# Altium project mcHFPro_ui.PrjPcb (part 2 of 2)

## Sheet ui_lo.SchDoc: mcHF Pro Transceiver UI board
size A3; Author: Krassi Atanassov; CompanyName: MØNKA; Engineer: For radio amateurs experimentation, non-commercial use only. Thank you!; Revision: 0.8.5; SheetTotal: 13
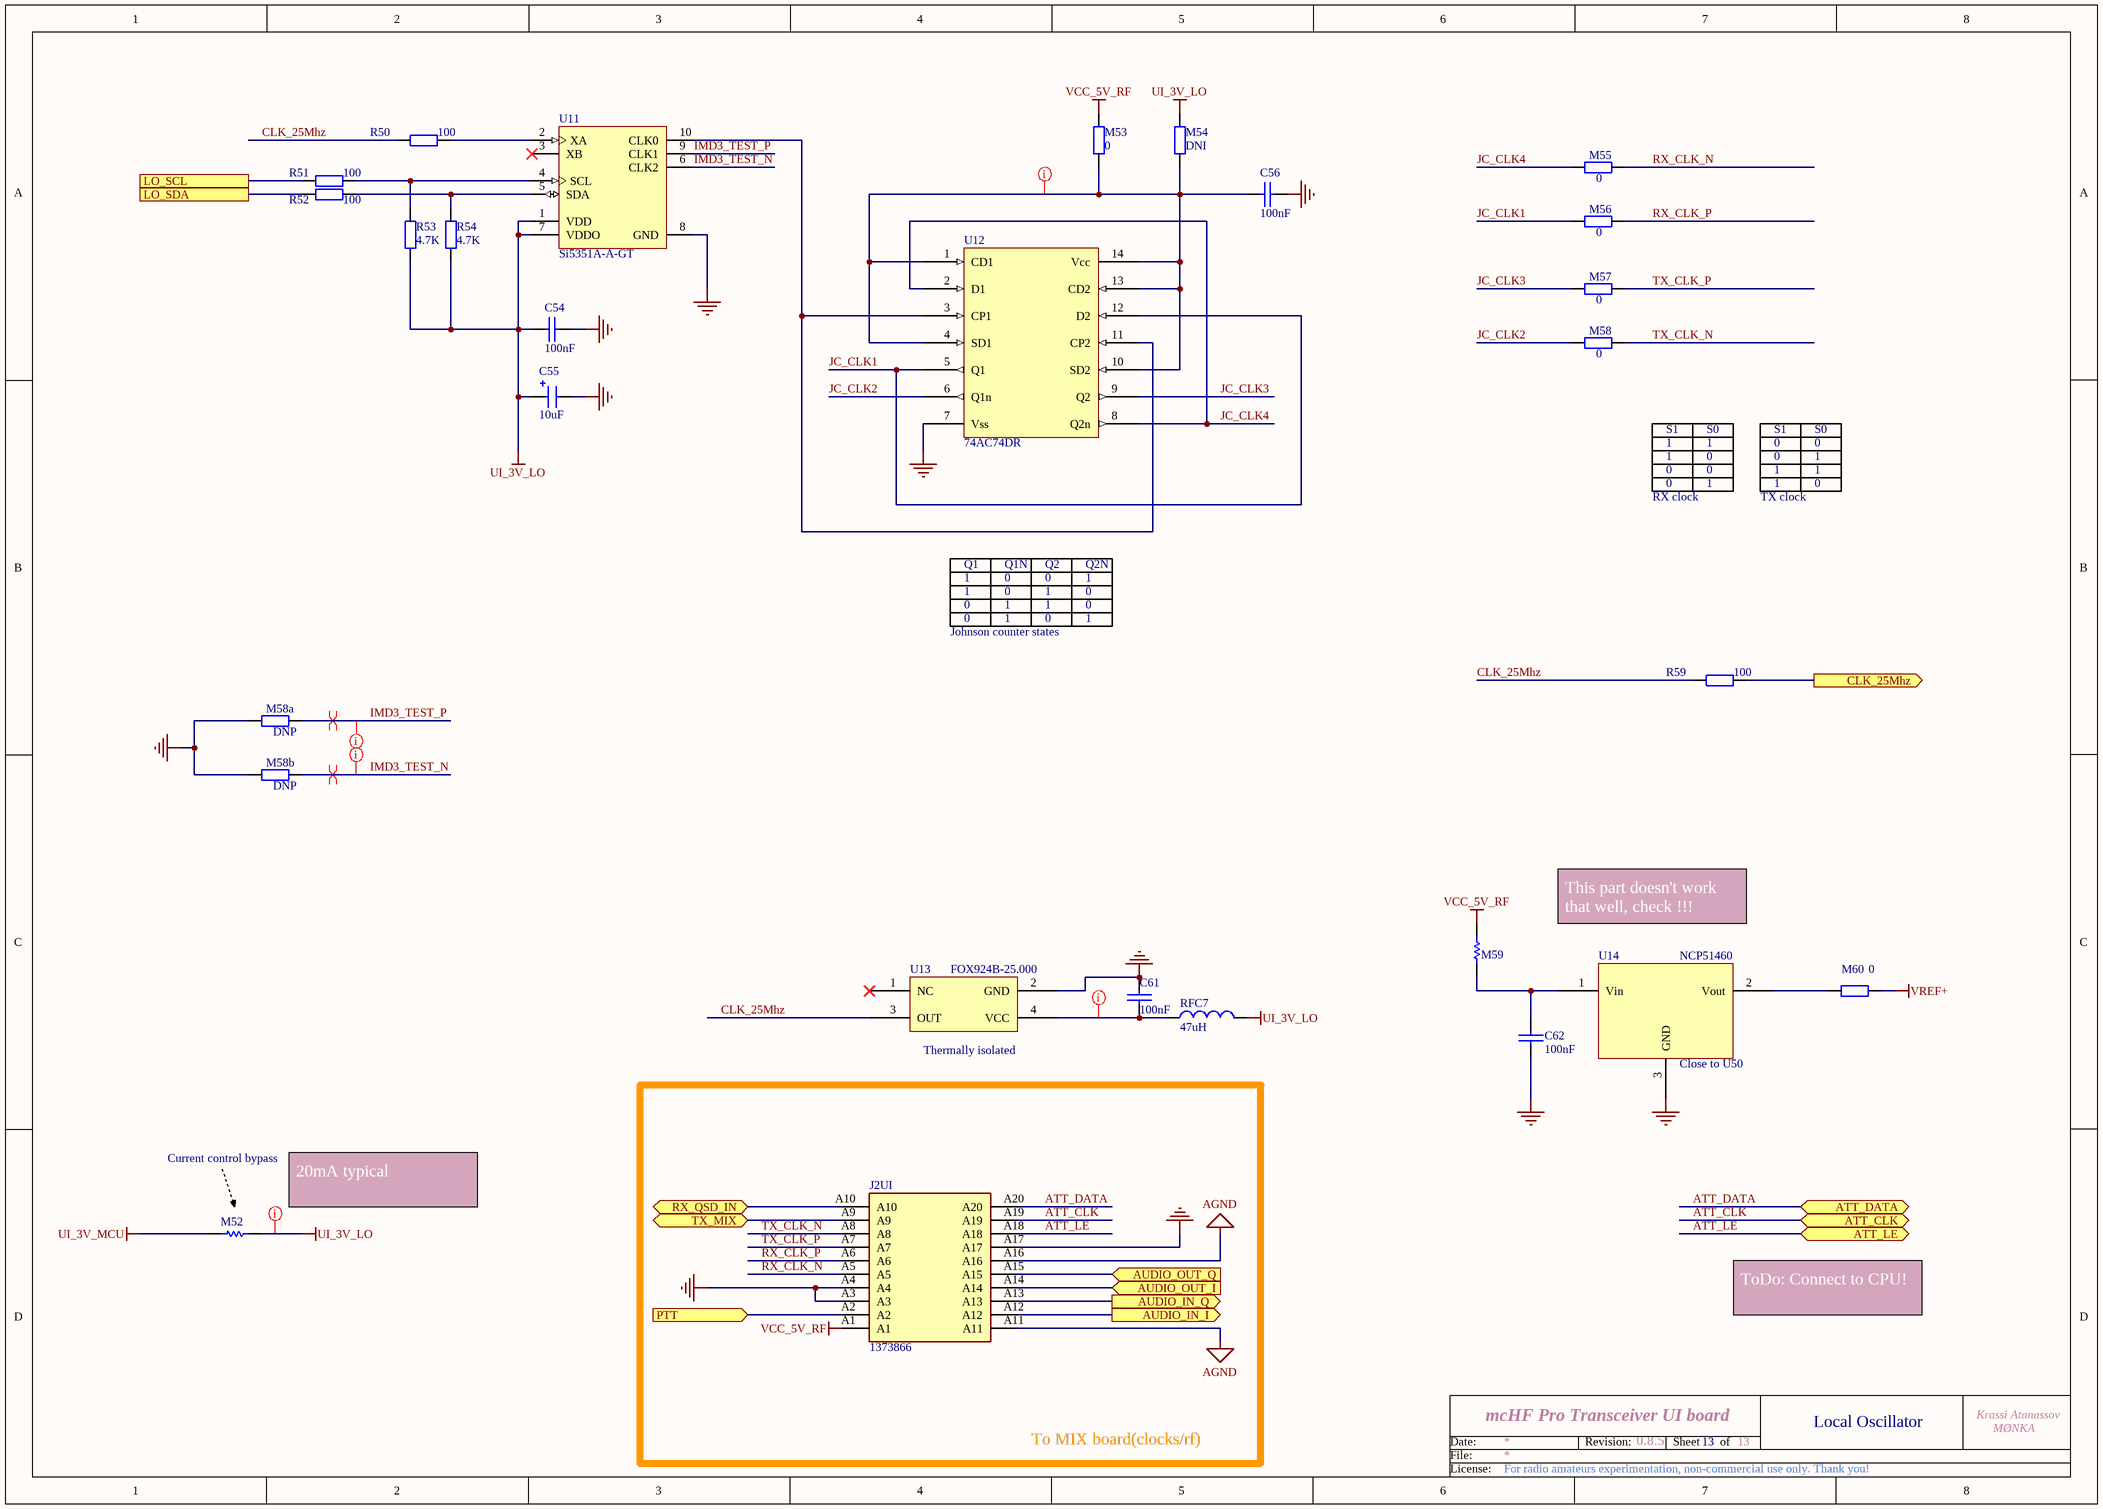
[diagram p7: ui_lo.SchDoc]

### Parts
C54  100nF  [0805]
C55  10uF  [1206_Elec_Cap]
C56  100nF  [0805]
C61  100nF  [0805]
C62  100nF  [0805]
J2UI  1373866  [YuanQi4mm]
M52  0  [SB_0603]  (value not drawn)  (net tie, no BOM)
M53  0  [0805]
M54  DNI  [0805]  (no BOM)
M55  0  [0805]
M56  0  [0805]
M57  0  [0805]
M58  0  [0805]
M58a  DNP  [0805]  (no BOM)
M58b  DNP  [0805]  (no BOM)
M59  0  [SB_0603]  (value not drawn)  (net tie, no BOM)
M60  0  [0805]
R50  100  [0805]
R51  100  [0805]
R52  100  [0805]
R53  4.7K  [0805]
R54  4.7K  [0805]
R59  100  [0805]
RFC7  47uH  [0805]
U11  Si5351A-A-GT  [SLAB-MSOP-10_N]
U12  74AC74DR  [SO-14]
U13  FOX924B-25.000  [2SMX-3SMXB]
U14  NCP51460  [SOT-23]

### Blocks framed on the sheet
To MIX board(clocks/rf): J2UI

### Ports
ATT_CLK (bidir), ATT_DATA (bidir), ATT_LE (bidir), AUDIO_IN_I (out), AUDIO_IN_Q (out), AUDIO_OUT_I (in), AUDIO_OUT_Q (in), CLK_25Mhz (out), LO_SCL, LO_SDA, PTT (in), RX_QSD_IN (bidir), TX_MIX (bidir)

### Nets
AGND: J2UI.A11 J2UI.A16
GND: C54.2 C55.2 C56.1 C61.1 C62.2 J2UI.A3 J2UI.A4 J2UI.A17 M58a.2 M58b.2 U11.8(GND) U12.7(Vss) U13.2(GND) U14.3(GND)
UI_3V_LO: C54.1 C55.1 M52.2 M54.2 R53.2 R54.2 RFC7.2 U11.1(VDD) U11.7(VDDO)
UI_3V_MCU: M52.1
VCC_5V_RF: J2UI.A1 M53.2 M59.2
VREF+: M60.1
ATT_CLK: J2UI.A19 ; port ATT_CLK
ATT_DATA: J2UI.A20 ; port ATT_DATA
ATT_LE: J2UI.A18 ; port ATT_LE
CLK_25Mhz: R50.2 R59.2 U13.3(OUT)
IMD3_TEST_N: M58b.1 U11.6(CLK2)
IMD3_TEST_P: M58a.1 U11.9(CLK1)
JC_CLK1: M56.2 U12.5(Q1) U12.12(D2)
JC_CLK2: M58.2 U12.6(Q1n)
JC_CLK3: M57.2 U12.9(Q2)
JC_CLK4: M55.2 U12.2(D1) U12.8(Q2n)
LO_SCL: R51.2 ; port LO_SCL
LO_SDA: R52.2 ; port LO_SDA
PTT: J2UI.A2 ; port PTT
RX_CLK_N: J2UI.A5 M55.1
RX_CLK_P: J2UI.A6 M56.1
RX_QSD_IN: J2UI.A10 ; port RX_QSD_IN
TX_CLK_N: J2UI.A8 M58.1
TX_CLK_P: J2UI.A7 M57.1
TX_MIX: J2UI.A9 ; port TX_MIX
NetC6_2: J2UI.A14 ; port AUDIO_OUT_I
NetC7_2: J2UI.A15 ; port AUDIO_OUT_Q
NetC8_2: J2UI.A12 ; port AUDIO_IN_I
NetC9_2: J2UI.A13 ; port AUDIO_IN_Q
NetC56_2: C56.2 M53.1 M54.1 U12.1(CD1) U12.4(SD1) U12.10(SD2) U12.13(CD2) U12.14(Vcc)
NetC61_2: C61.2 RFC7.1 U13.4(VCC)
NetC62_1: C62.1 M59.1 U14.1(Vin)
NetM60_2: M60.2 U14.2(Vout)
NetR50_1: R50.1 U11.2(XA)
NetR51_1: R51.1 R53.1 U11.4(SCL)
NetR52_1: R52.1 R54.1 U11.5(SDA)
NetR59_1: R59.1 ; port CLK_25Mhz
NetU11_10: U11.10(CLK0) U12.3(CP1) U12.11(CP2)

Not connected (* = marked no-connect by the designer): U11 3(XB)*; U13 1(NC)*

### Layout directives
rule Width Constraint [Pref Width = 12mil    Min Width = 12mil    Max Width = 12mil]: NetC56_2, NetC61_2, UI_3V_LO
differential pair: IMD3_TEST_N, IMD3_TEST_P
rule Matched Net Lengths [Tolerance = 300mil]: IMD3_TEST_N, IMD3_TEST_P

### Notes on the sheet
- S1
- 1
- S0
- 0
- RX clock
- TX clock
- Q1
- Q1N
- Q2
- Q2N
- Johnson counter states
- This part doesn't work that well, check !!!
- (near U13) Thermally isolated
- (near U14) Close to U50
- Current control bypass
- (near M52) 20mA typical
- ToDo: Connect to CPU!
- 13
- Local Oscillator
- Date:
- File:
- Revision:
- Sheet
- of
- License:

### Library data of the parts
C54 C56 C62 = CAP: as C22 on sheet ui_conn; Price: 0.068
C55 = CAP-POL: Electrolitic capacitor; Order: FN 233-3009; QT Order: QCC-00166; Price: 0.204
C61 = CAP: Capacitor; Order: FN 174-0673; QT Order: QCC-00154; Price: 0.068
J2UI = YQ_20p: SMD male connector, nominal current: 2.2 A, Test voltage: 840 VAC, number of positions: 20, pitch: 1.27 mm, color: black, contact surface: Gold, type of contact: Male connector, mounting: SMD soldering; Manufacturer_Name: Phoenix Contact; Geometry.Height: 6.75mm; Mouser Part Number: 651-1373866; Mouser Price/Stock: https://www.mouser.co.uk/ProductDetail/Phoenix-Contact/1373866?qs=2SLPxufLcgAs0enIXKjUUw%3D%3D; Manufacturer_Part_Number: 1373866; Datasheet Link: http://www.phoenixcontact.com/gb/produkte/1373866
M52 M59 = Link: Value: 1K; Published: 8-Jun-2000; Revision: July-2002: Re-released for DXP Platform.; Publisher: Altium Limited
M53-M58 M58a M58b M60 = RES: Resistor; Order: FN 933-3681; QT Order: QCR-00268; Price: 0.009
R50-R52 R59 = RES: Resistor; Order: FN 933-2375; QT Order: QCR-00301; Price: 0.027
R53 R54 = RES: as R21a on sheet ui_conn; Price: 0.024
RFC7 = Inductor: Order: FN 166-9895; Price: 0.16
U11 = Si5351A-A-GT: I2C-Programmable Any-Frequency CMOS Clock Generator + VCXO, 2.5 / 3.3 V, 0.008 to 160 MHz Output, -40 to 85 degC, 10-pin SOP; Manufacturer: Silicon Labs; Output Format: LVCMOS; Reference Inputs: 1; VDD: 2.5 V; 3.3 V; Sub-Family: Clock Generators; Notes: Farnell had it cheap (like 80 pence); DatasheetVersion: Rev. 0.95; PackageReference: MSOP-10; PackageDescription: 10-Pin Mini Small Outline Package, Body 3 x 3 mm, Pitch 0.5 mm; Supplier 1: Digi-Key; Supplier Part Number 1: 336-1994-5-ND; Supplier 2: Mouser; Supplier Part Number 2: 634-SI5351A-A-GT; Output Frequency (MHz): 0.008 to 160; Mounting Technology: Surface Mount; Code_JEDEC: MO-187; Code_IPC: J-STD-020; PartNumber: Si5351A-A-GT; ComponentLink1Description: Manufacturer URL; ComponentLink1URL: http://www.silabs.com/; ComponentLink2Description: Datasheet; ComponentLink2URL: http://www.silabs.com/Support%20Documents/TechnicalDocs/Si5351.pdf; ComponentLink3Description: Package Specification; ComponentLink3URL: http://www.silabs.com/Support Documents/TechnicalDocs/C8051T60x.pdf
U12 = 74LCX74M: Low Voltage Dual D-Type Positive Edge-Triggered  Flip-Flop with 5V Tolerant Inputs; Order: FN 985-3502; QT Order: QCI-00713; Notes: Can use PO74G74A, but remove M52, install M53; Price: 0.23
U13 = FOX924B-16.000: TCXO; Order: FN 206-3959; Price: 2.77
U14 = NCP51460: 3.3V voltage reference, SOT-23

## Sheet ui_ext_conn.SchDoc: mcHF Pro Transceiver UI board
size A3; Author: Krassi Atanassov; CompanyName: MØNKA; Engineer: For radio amateurs experimentation, non-commercial use only. Thank you!; Revision: 0.8.5; SheetTotal: 13
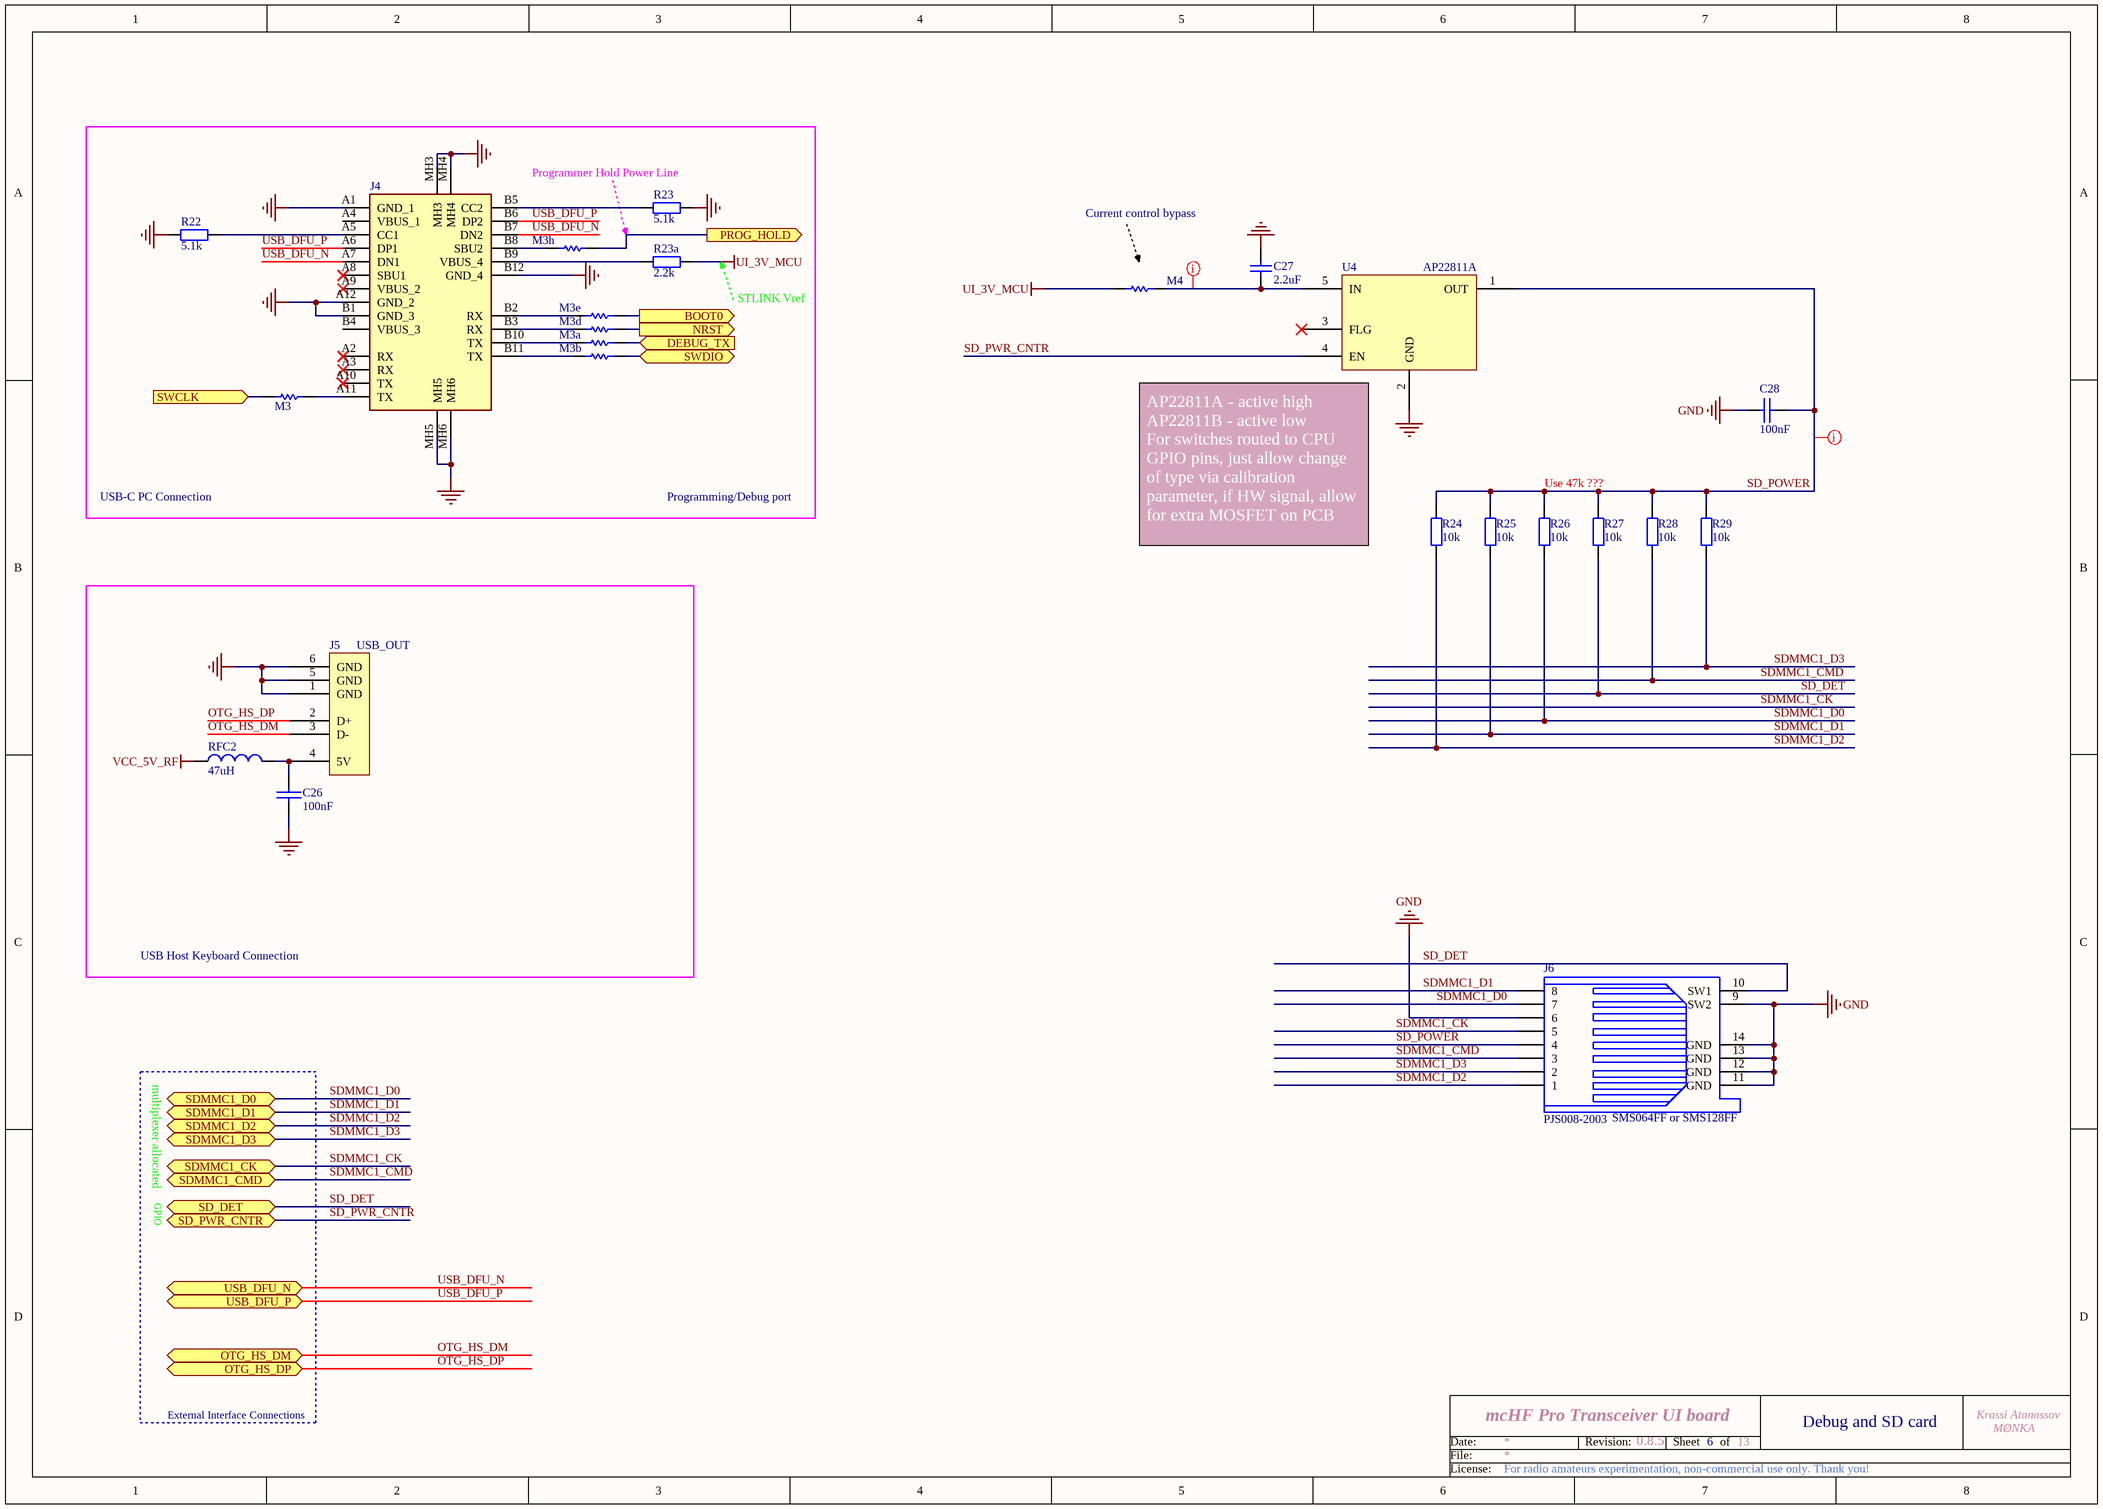
[diagram p8: ui_ext_conn.SchDoc]

### Parts
C26  100nF  [0805]
C27  2.2uF  [0805]
C28  100nF  [0805]
J4  219320-0001  [usbc_24p]  (value not drawn)
J5  USB_OUT  [USB_OUT_A]
J6  PJS008-2003  [PJS008-2003-1]
M3  0  [SB_0603_NO]  (value not drawn)  (net tie, no BOM)
M3a  0  [SB_0603_NO]  (value not drawn)  (net tie, no BOM)
M3b  0  [SB_0603_NO]  (value not drawn)  (net tie, no BOM)
M3d  0  [SB_0603_NO]  (value not drawn)  (net tie, no BOM)
M3e  0  [SB_0603_NO]  (value not drawn)  (net tie, no BOM)
M3h  0  [SB_0603_NO]  (value not drawn)  (net tie, no BOM)
M4  0  [SB_0603]  (value not drawn)  (net tie, no BOM)
R22  5.1k  [0805]
R23  5.1k  [0805]
R23a  2.2k  [0805]
R24  10k  [0805]
R25  10k  [0805]
R26  10k  [0805]
R27  10k  [0805]
R28  10k  [0805]
R29  10k  [0805]
RFC2  47uH  [0805]
U4  AP22811A  [SOT25-5]

### Blocks framed on the sheet
USB Host Keyboard Connection: C26 J5 RFC2

### Ports
BOOT0 (out), DEBUG_TX (in), NRST (out), OTG_HS_DM (bidir), OTG_HS_DP (bidir), PROG_HOLD (out), SD_DET (bidir), SD_PWR_CNTR (bidir), SDMMC1_CK (bidir), SDMMC1_CMD (bidir), SDMMC1_D0 (bidir), SDMMC1_D1 (bidir), SDMMC1_D2 (bidir), SDMMC1_D3 (bidir), SWCLK (in), SWDIO (bidir), USB_DFU_N (bidir), USB_DFU_P (bidir)

### Nets
GND: C26.1 C27.1 C28.2 J4.A1(GND_1) J4.A12(GND_2) J4.B1(GND_3) J4.B12(GND_4) J4.MH3 J4.MH4 J4.MH5 J4.MH6 J5.1(GND) J5.5(GND) J5.6(GND) J6.6 J6.9(SW2) J6.11(GND) J6.12(GND) J6.13(GND) J6.14(GND) R22.1 R23.2 U4.2(GND)
UI_3V_MCU: M4.1 R23a.2
VCC_5V_RF: RFC2.1
BOOT0: M3e.1 ; port BOOT0
NRST: M3d.2 ; port NRST
OTG_HS_DM: J5.3(D-) ; port OTG_HS_DM
OTG_HS_DP: J5.2(D+) ; port OTG_HS_DP
PROG_HOLD: M3h.1 ; port PROG_HOLD
SD_DET: J6.10(SW1) R27.2 ; port SD_DET
SD_POWER: C28.1 J6.4 R24.1 R25.1 R26.1 R27.1 R28.1 R29.1 U4.1(OUT)
SD_PWR_CNTR: U4.4(EN) ; port SD_PWR_CNTR
SDMMC1_CK: J6.5 ; port SDMMC1_CK
SDMMC1_CMD: J6.3 R28.2 ; port SDMMC1_CMD
SDMMC1_D0: J6.7 R26.2 ; port SDMMC1_D0
SDMMC1_D1: J6.8 R25.2 ; port SDMMC1_D1
SDMMC1_D2: J6.1 R24.2 ; port SDMMC1_D2
SDMMC1_D3: J6.2 R29.2 ; port SDMMC1_D3
SWCLK: M3.2 ; port SWCLK
SWDIO: M3b.2 ; port SWDIO
USART2_TX: M3a.2 ; port DEBUG_TX
USB_DFU_N: J4.A7(DN1) J4.B7(DN2) ; port USB_DFU_N
USB_DFU_P: J4.A6(DP1) J4.B6(DP2) ; port USB_DFU_P
NetC26_2: C26.2 J5.4(5V) RFC2.2
NetC27_2: C27.2 M4.2 U4.5(IN)
NetJ4_A5: J4.A5(CC1) R22.2
NetJ4_A11: J4.A11(TX) M3.1
NetJ4_B2: J4.B2(RX) M3e.2
NetJ4_B3: J4.B3(RX) M3d.1
NetJ4_B5: J4.B5(CC2) R23.1
NetJ4_B8: J4.B8(SBU2) M3h.2
NetJ4_B9: J4.B9(VBUS_4) R23a.1
NetJ4_B10: J4.B10(TX) M3a.1
NetJ4_B11: J4.B11(TX) M3b.1

Not connected (* = marked no-connect by the designer): J4 A2(RX)* A3(RX)* A4(VBUS_1) A8(SBU1)* A9(VBUS_2)* A10(TX)* B4(VBUS_3); U4 3(FLG)*

### Layout directives
rule Width Constraint [Pref Width = 12mil    Min Width = 12mil    Max Width = 12mil]: NetC27_2, SD_POWER

### Notes on the sheet
- Programmer Hold Power Line
- Current control bypass
- STLINK Vref
- USB-C PC Connection
- Programming/Debug port
- Use 47k ???
- (near U4) AP22811A - active high                                 AP22811B - active low                             For switches routed to CPU GPIO pins, just allow change of type via calibration parameter, if HW signal, allow for extra MOSFET on PCB
- multiplexer allocated
- (near J6) SMS064FF or SMS128FF
- GPIO
- External Interface Connections
- 6
- Debug and SD card
- Date:
- File:
- Revision:
- Sheet
- of
- License:

### Library data of the parts
C26 = CAP: Capacitor; Order: FN 174-0673; QT Order: QCC-00154; Price: 0.068
C27 = CAP SMD 0603  X5R 1礔 25V 10%: 0603  X5R 1礔; Rated voltage: 25V; Tolerance: 10%; Manufacturer: *; Manufacturer P/N: *; Order code Farnell: 1288202RL; Value: 1礔; Power: *; Technology: X5R; Temperature  Factor: *; Temperature Max: +125癈; Temperature Min: -55癈; STS Code: *
C28 = CAP: Capacitor; Order: FN 282-1264; QT Order: QCC-00157; Price: 0.089
J4 = usbc_24p: Universal Serial Bus (USB) Shielded I/O Receptacle, Type C, Vertical, Surface Mount, Height 8.8mm, 16 Circuits, Gold (Au) Flash Plating; Manufacturer_Name: Molex; Geometry.Height: 9.05mm; Mouser Part Number: 538-219320-0001; Mouser Price/Stock: https://www.mouser.co.uk/ProductDetail/Molex/219320-0001?qs=rQFj71Wb1eXha8qVBIXu3A%3D%3D; Manufacturer_Part_Number: 219320-0001; Datasheet Link: https://www.molex.com/content/dam/molex/molex-dot-com/products/automated/en-us/salesdrawingpdf/219/219320/2193200001_sd.pdf?inline
J5 = USB_OUT: USB Host Connector
J6 = microSD-PJS008-2003: Memory Card Connectors MicroSD Card Conn Revrs Mnt Push-Push; Manuf_1: YAMAICHI; Manuf_Part_1: PJS008-2003-1; Distrib: *; Order: PJS008-2003-1; ECCN_US/EU: n/a
M3 M3a M3b M3d M3e M3h M4 = Link: Value: 1K; Published: 8-Jun-2000; Revision: July-2002: Re-released for DXP Platform.; Publisher: Altium Limited
R22 R23 R23a R24 = RES: Resistor; Order: FN 146-9857; QT Order: QCR-00349; QT Price: 0.03; Price: 0.046
R25-R29 = RES: Resistor; Order: FN 146-9857; Price: 0.046
RFC2 = Inductor: Order: FN 166-9895; Price: 0.16
U4 = AP22811: High-side switch; Order: FN 274-8550

## Sheet ui_codec.SchDoc: mcHF Pro Transceiver UI board
size A3; Author: Krassi Atanassov; CompanyName: MØNKA; Engineer: For radio amateurs experimentation, non-commercial use only. Thank you!; Revision: 0.8.5; SheetTotal: 13
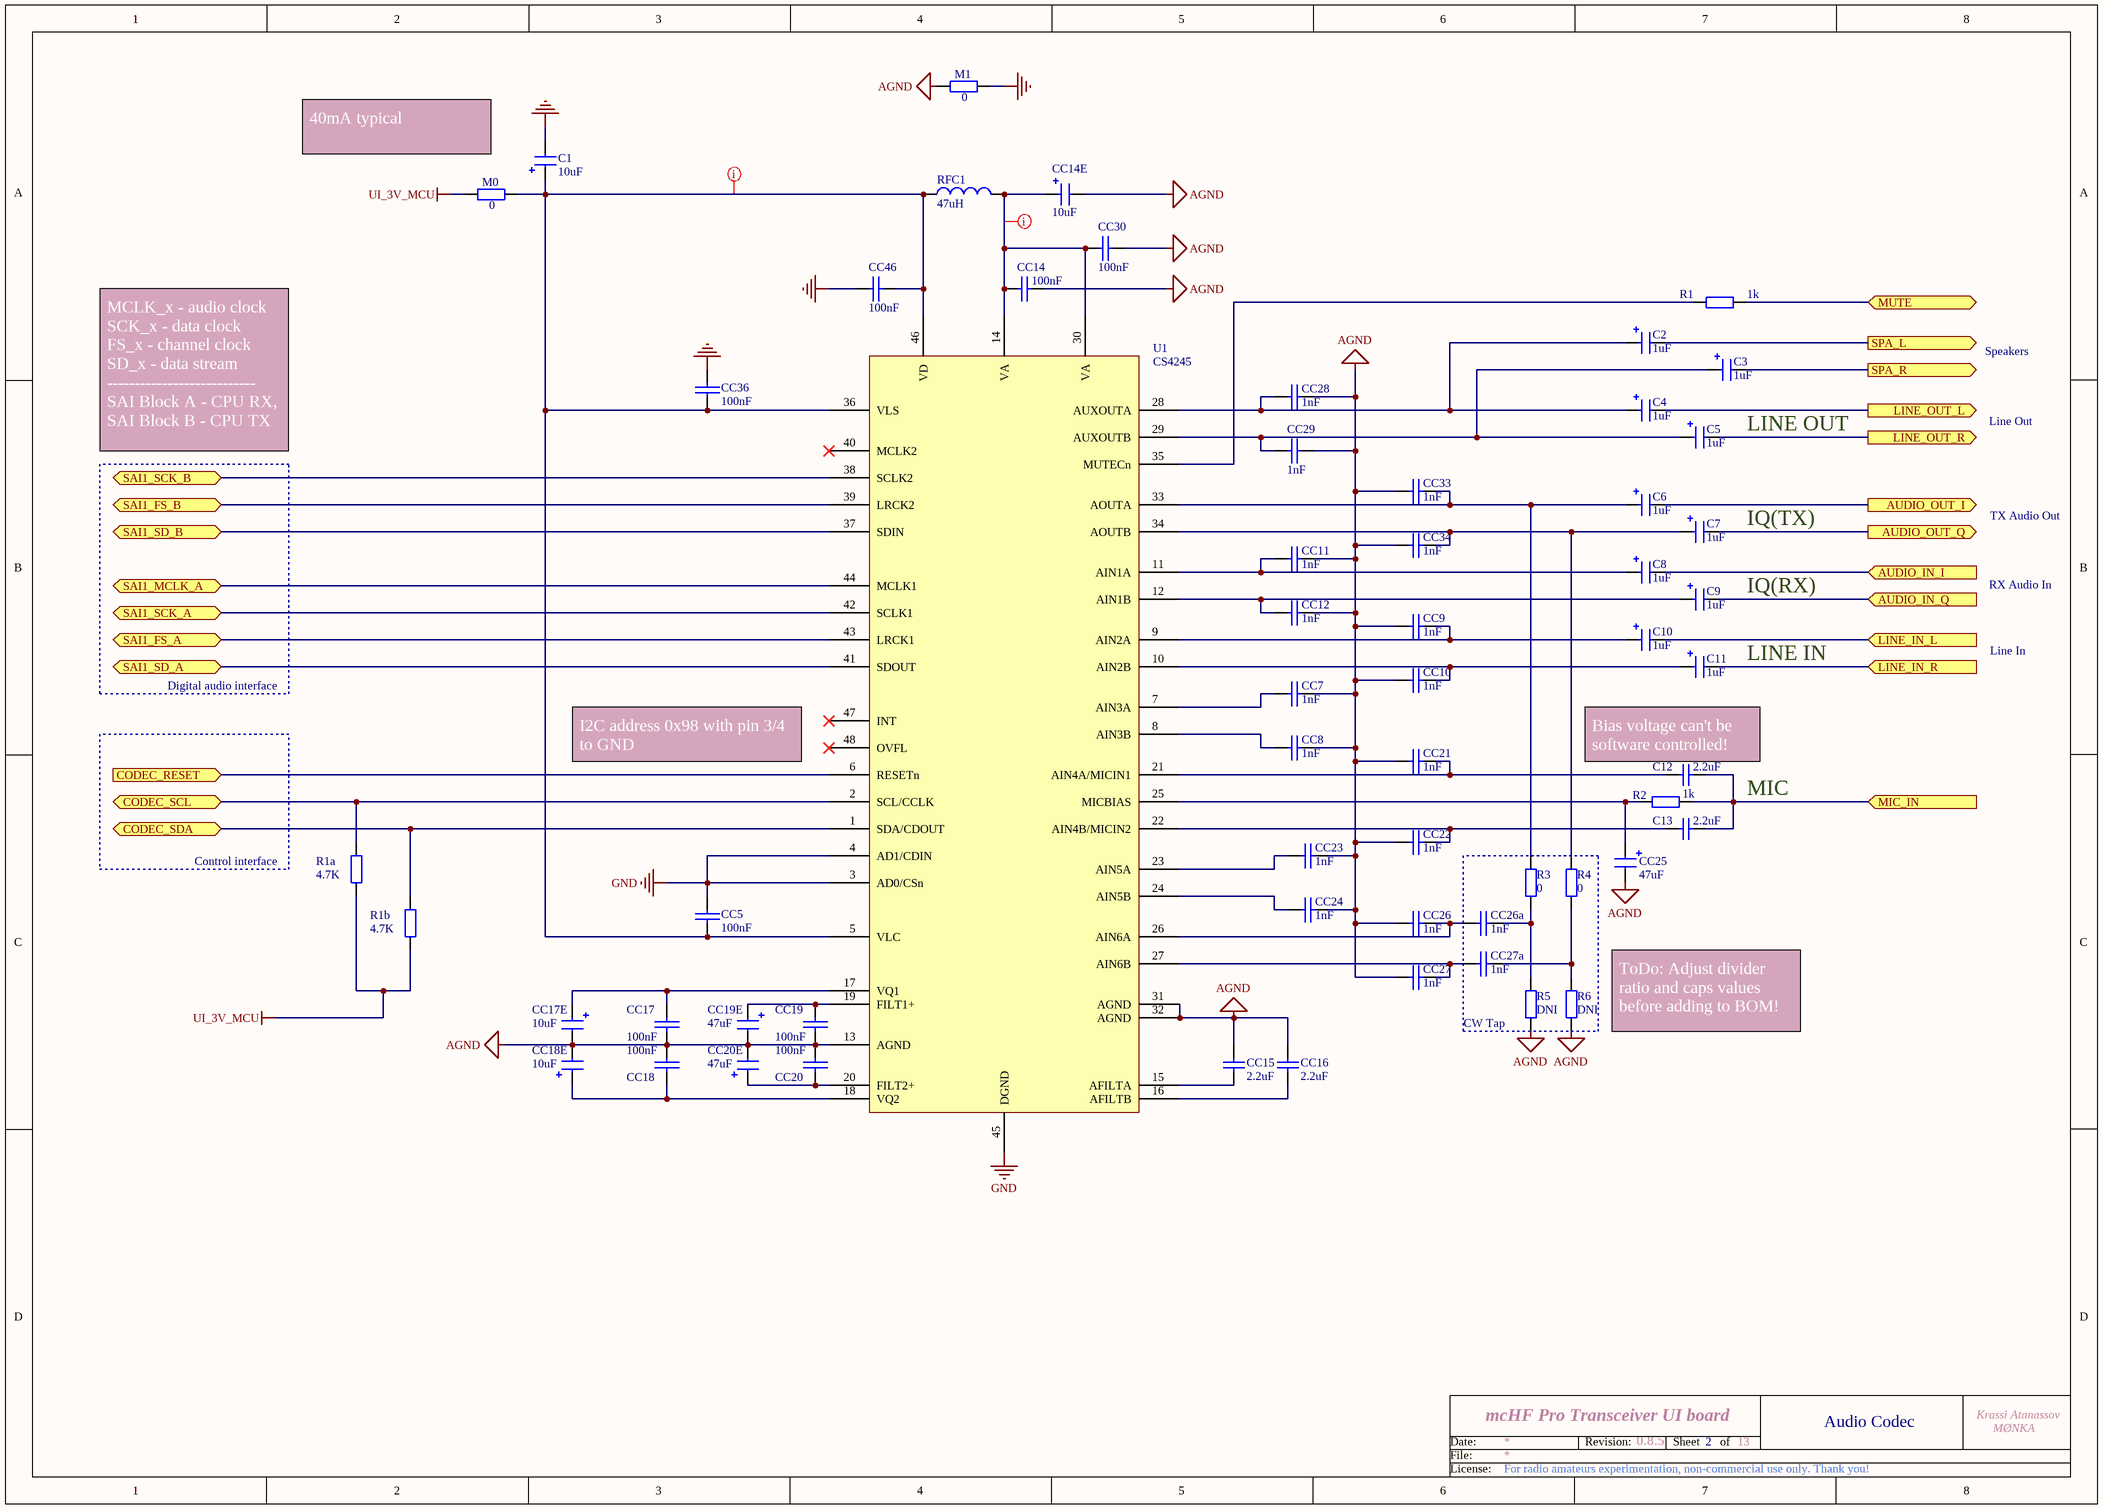
[diagram p9: ui_codec.SchDoc]

### Parts
C1  10uF  [1206_Elec_Cap]
C2  1uF  [1206_Elec_Cap]
C3  1uF  [1206_Elec_Cap]
C4  1uF  [1206_Elec_Cap]
C5  1uF  [1206_Elec_Cap]
C6  1uF  [1206_Elec_Cap]
C7  1uF  [1206_Elec_Cap]
C8  1uF  [1206_Elec_Cap]
C9  1uF  [1206_Elec_Cap]
C10  1uF  [1206_Elec_Cap]
C11  1uF  [1206_Elec_Cap]
C12  2.2uF  [0805]
C13  2.2uF  [0805]
CC5  100nF  [0805]
CC7  1nF  [0805]
CC8  1nF  [0805]
CC9  1nF  [0805]
CC10  1nF  [0805]
CC11  1nF  [0805]
CC12  1nF  [0805]
CC14  100nF  [0805]
CC14E  10uF  [1206_Elec_Cap]
CC15  2.2uF  [0805]
CC16  2.2uF  [0805]
CC17  100nF  [0805]
CC17E  10uF  [1206_Elec_Cap]
CC18  100nF  [0805]
CC18E  10uF  [1206_Elec_Cap]
CC19  100nF  [0805]
CC19E  47uF  [1206_Elec_Cap]
CC20  100nF  [0805]
CC20E  47uF  [1206_Elec_Cap]
CC21  1nF  [0805]
CC22  1nF  [0805]
CC23  1nF  [0805]
CC24  1nF  [0805]
CC25  47uF  [1206_Elec_Cap]
CC26  1nF  [0805]
CC26a  1nF  [0805]
CC27  1nF  [0805]
CC27a  1nF  [0805]
CC28  1nF  [0805]
CC29  1nF  [0805]
CC30  100nF  [0805]
CC33  1nF  [0805]
CC34  1nF  [0805]
CC36  100nF  [0805]
CC46  100nF  [0805]
M0  0  [0805]
M1  0  [0805]
R1  1k  [0805]
R1a  4.7K  [0805]
R1b  4.7K  [0805]
R2  1k  [0805]
R3  0  [0805]
R4  0  [0805]
R5  DNI  [0805]  (no BOM)
R6  DNI  [0805]  (no BOM)
RFC1  47uH  [0805]
U1  CS4245  [QUAD48]

### Blocks framed on the sheet
CW Tap: CC26a CC27a R3-R6

### Ports
AUDIO_IN_I (in), AUDIO_IN_Q (in), AUDIO_OUT_I (out), AUDIO_OUT_Q (out), CODEC_RESET (in), CODEC_SCL (bidir), CODEC_SDA (bidir), LINE_IN_L (in), LINE_IN_R (in), LINE_OUT_L (out), LINE_OUT_R (out), MIC_IN (in), MUTE (bidir), SAI1_FS_A (bidir), SAI1_FS_B (bidir), SAI1_MCLK_A (bidir), SAI1_SCK_A (bidir), SAI1_SCK_B (bidir), SAI1_SD_A (bidir), SAI1_SD_B (bidir), SPA_L (out), SPA_R (out)

### Nets
AGND: CC7.1 CC8.1 CC9.2 CC10.2 CC11.1 CC12.1 CC14.1 CC14E.2 CC15.1 CC16.1 CC17.1 CC17E.2 CC18.2 CC18E.2 CC19.1 CC19E.2 CC20.2 CC20E.2 CC21.2 CC22.2 CC23.1 CC24.1 CC25.2 CC26.2 CC27.2 CC28.1 CC29.1 CC30.1 CC33.2 CC34.2 M1.2 R5.2 R6.2 U1.13(AGND) U1.31(AGND) U1.32(AGND)
GND: C1.2 CC5.2 CC36.2 CC46.2 M1.1 U1.3(AD0/CSn) U1.4(AD1/CDIN) U1.45(DGND)
UI_3V_MCU: M0.2 R1a.2 R1b.2
CODEC_RESET: U1.6(RESETn) ; port CODEC_RESET
CODEC_SCL: R1a.1 U1.2(SCL/CCLK) ; port CODEC_SCL
CODEC_SDA: R1b.1 U1.1(SDA/CDOUT) ; port CODEC_SDA
LINE_IN_L: C10.2 ; port LINE_IN_L
LINE_IN_R: C11.2 ; port LINE_IN_R
LINE_OUT_L: C4.2 ; port LINE_OUT_L
LINE_OUT_R: C5.2 ; port LINE_OUT_R
MIC_IN: C12.2 C13.2 R2.1 ; port MIC_IN
MUTE: R1.1 ; port MUTE
SAI1_FS_A: U1.43(LRCK1) ; port SAI1_FS_A
SAI1_FS_B: U1.39(LRCK2) ; port SAI1_FS_B
SAI1_MCLK_A: U1.44(MCLK1) ; port SAI1_MCLK_A
SAI1_SCK_A: U1.42(SCLK1) ; port SAI1_SCK_A
SAI1_SCK_B: U1.38(SCLK2) ; port SAI1_SCK_B
SAI1_SD_A: U1.41(SDOUT) ; port SAI1_SD_A
SAI1_SD_B: U1.37(SDIN) ; port SAI1_SD_B
SPA_L: C2.2 ; port SPA_L
SPA_R: C3.2 ; port SPA_R
NetC1_1: C1.1 CC5.1 CC36.1 CC46.1 M0.1 RFC1.1 U1.5(VLC) U1.36(VLS) U1.46(VD)
NetC2_1: C2.1 C4.1 CC28.2 U1.28(AUXOUTA)
NetC3_1: C3.1 C5.1 CC29.2 U1.29(AUXOUTB)
NetC6_1: C6.1 CC33.1 R3.1 U1.33(AOUTA)
NetC6_2: C6.2 ; port AUDIO_OUT_I
NetC7_1: C7.1 CC34.1 R4.1 U1.34(AOUTB)
NetC7_2: C7.2 ; port AUDIO_OUT_Q
NetC8_1: C8.1 CC11.2 U1.11(AIN1A)
NetC8_2: C8.2 ; port AUDIO_IN_I
NetC9_1: C9.1 CC12.2 U1.12(AIN1B)
NetC9_2: C9.2 ; port AUDIO_IN_Q
NetC10_1: C10.1 CC9.1 U1.9(AIN2A)
NetC11_1: C11.1 CC10.1 U1.10(AIN2B)
NetC12_1: C12.1 CC21.1 U1.21(AIN4A/MICIN1)
NetC13_1: C13.1 CC22.1 U1.22(AIN4B/MICIN2)
NetCC7_2: CC7.2 U1.7(AIN3A)
NetCC8_2: CC8.2 U1.8(AIN3B)
NetCC14_2: CC14.2 CC14E.1 CC30.2 RFC1.2 U1.14(VA) U1.30(VA)
NetCC15_2: CC15.2 U1.15(AFILTA)
NetCC16_2: CC16.2 U1.16(AFILTB)
NetCC17_2: CC17.2 CC17E.1 U1.17(VQ1)
NetCC18_1: CC18.1 CC18E.1 U1.18(VQ2)
NetCC19_2: CC19.2 CC19E.1 U1.19(FILT1+)
NetCC20_1: CC20.1 CC20E.1 U1.20(FILT2+)
NetCC23_2: CC23.2 U1.23(AIN5A)
NetCC24_2: CC24.2 U1.24(AIN5B)
NetCC25_1: CC25.1 R2.2 U1.25(MICBIAS)
NetCC26_1: CC26.1 CC26a.2 U1.26(AIN6A)
NetCC26a_1: CC26a.1 R3.2 R5.1
NetCC27_1: CC27.1 CC27a.2 U1.27(AIN6B)
NetCC27a_1: CC27a.1 R4.2 R6.1
NetR1_2: R1.2 U1.35(MUTECn)

Not connected (* = marked no-connect by the designer): U1 40(MCLK2)* 47(INT)* 48(OVFL)*

### Layout directives
rule Width Constraint [Pref Width = 12mil    Min Width = 12mil    Max Width = 12mil]: NetC1_1, NetCC14_2

### Notes on the sheet
- 40mA typical
- Speakers
- MCLK_x - audio clock     SCK_x - data clock       FS_x - channel clock       SD_x - data stream         ---------------------------    SAI Block A - CPU RX, SAI Block B - CPU TX
- LINE OUT
- Line Out
- TX Audio Out
- (near C7) IQ(TX)
- RX Audio In
- IQ(RX)
- Line In
- Digital audio interface
- LINE IN
- I2C address 0x98 with pin 3/4 to GND
- (near C12) Bias voltage can't be software controlled!
- MIC
- Control interface
- (near R6) ToDo: Adjust divider ratio and caps values before adding to BOM!
- 2
- Audio Codec
- Date:
- File:
- Revision:
- Sheet
- of
- License:

### Library data of the parts
C1 CC17E CC18E = CAP-POL: Electrolitic capacitor; Order: FN 233-3009; QT Order: QCC-00166; Price: 0.204
C2 = CAP-POL: Electrolitic capacitor; Order: FN 145-7406; QT Order: QCC-00165; Notes: Tantalum capacitor; Price: 0.235
C3-C11 = CAP-POL: Electrolitic capacitor; Order: FN 145-7406; QT Order: QCC-00165; Price: 0.235
C12 C13 CC15 = CAP: Capacitor; Value: 100nF; Published: 8-Jun-2000; Revision: July-2002: Re-released for DXP Platform.; Publisher: Altium Limited
CC5 CC14 CC17-CC20 CC30 CC36 CC46 = CAP: Capacitor; Order: FN 252-2090; QT Order: QCC-00154; Price: 0.068
CC7-CC12 CC21-CC24 CC26 CC26a CC27 CC27a CC28 CC29 CC33 CC34 = CAP: Capacitor
CC14E = CAP-POL: Electrolitic capacitor; Order: FN 233-3009; QT Order: QCC-00166; Notes: Tantalum capacitor; Price: 0.204
CC16 = CAP: Capacitor; Value: 100nF; Notes: Ceramic Capacitor, low ESR; Published: 8-Jun-2000; Revision: July-2002: Re-released for DXP Platform.; Publisher: Altium Limited
CC19E CC25 = CAP-POL: Electrolitic capacitor; Notes: Tantalum Capacitor; Price: 0.204
CC20E = CAP-POL: Electrolitic capacitor; Price: 0.204
M0 M1 = RES: Resistor; Order: FN 933-3681; QT Order: QCR-00268; Price: 0.009
R1 R2 = RES: Resistor; Order: FN 933-2421; QT Order: QCR-00279; Price: 0.013
R1a R1b = RES: Resistor; Order: FN 200-8383; QT Order: QCR-00341; Price: 0.024
R3-R6 = RES: Resistor; Price: 0.013
RFC1 = Inductor: Order: FN 166-9895; Price: 0.16
U1 = CS4245: Audio CODEC

## Sheet ui_lora.SchDoc: mcHF Pro Transceiver UI board
size A3; Author: Krassi Atanassov; CompanyName: MØNKA; Engineer: For radio amateurs experimentation, non-commercial use only. Thank you!; Revision: 0.8.5; SheetTotal: 13
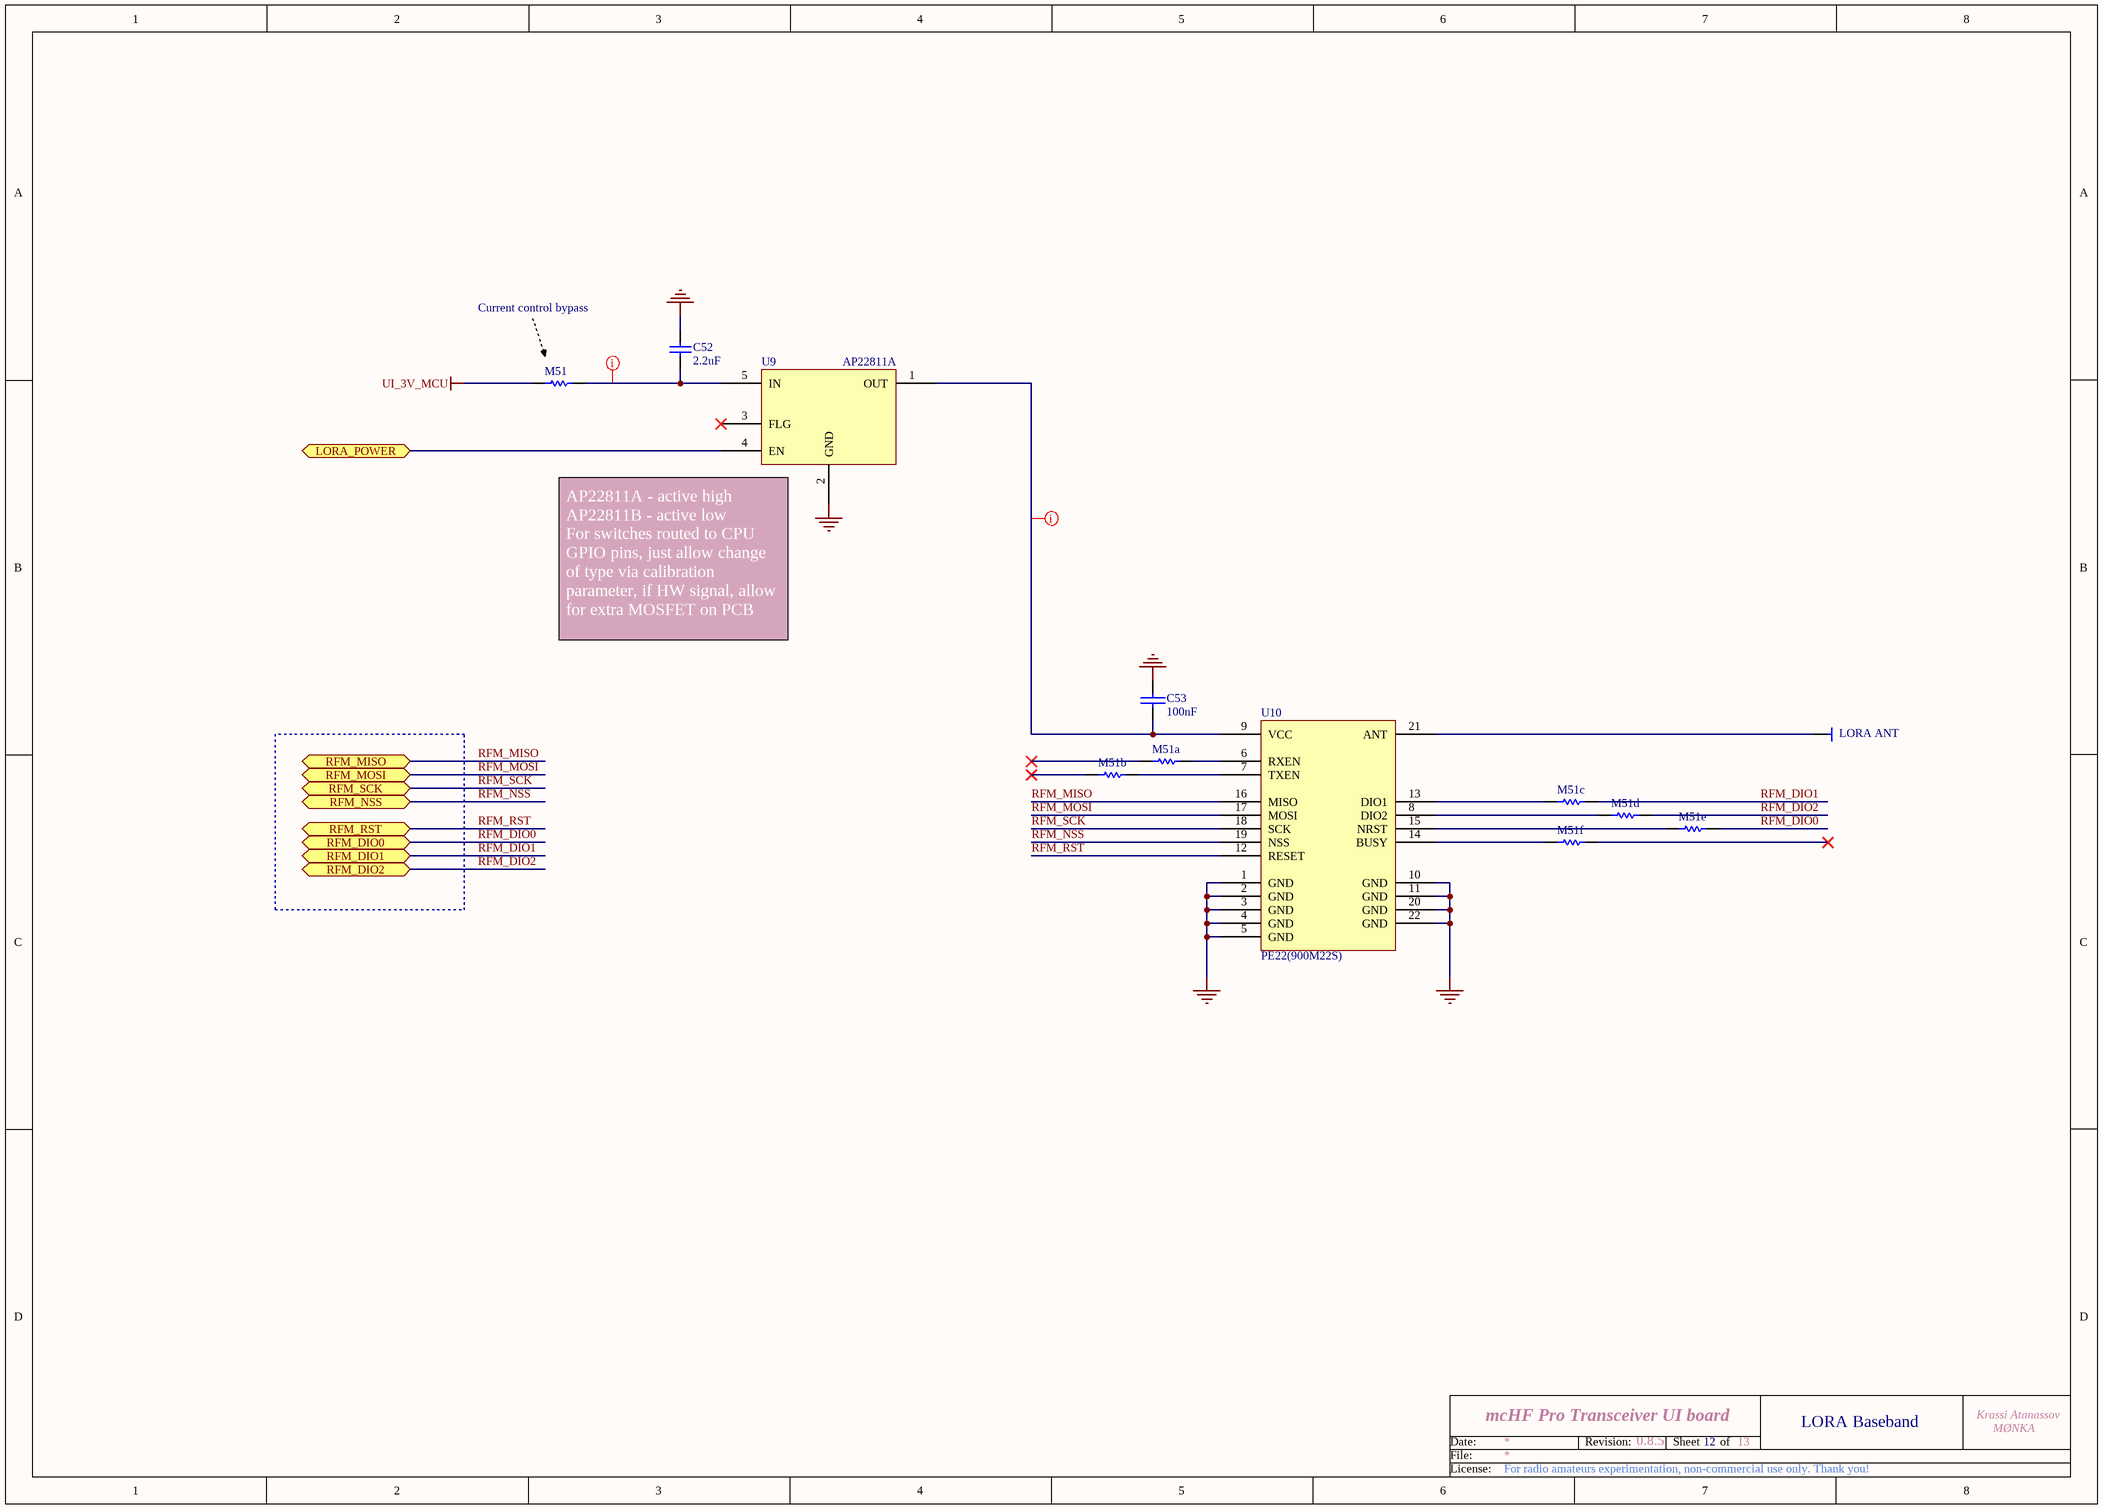
[diagram p10: ui_lora.SchDoc]

### Parts
C52  2.2uF  [0805]
C53  100nF  [0805]
LORA_ANT  TP  [lora_ant_pad]  (value not drawn)  (no BOM)
M51  0  [SB_0603]  (value not drawn)  (net tie, no BOM)
M51a  0  [SB_0603]  (value not drawn)  (net tie, no BOM)
M51b  0  [SB_0603]  (value not drawn)  (net tie, no BOM)
M51c  0  [SB_0603]  (value not drawn)  (net tie, no BOM)
M51d  0  [SB_0603]  (value not drawn)  (net tie, no BOM)
M51e  0  [SB_0603]  (value not drawn)  (net tie, no BOM)
M51f  0  [SB_0603]  (value not drawn)  (net tie, no BOM)
U9  AP22811A  [SOT25-5]
U10  PE22(900M22S)  [PE22(900M22S)]

### Ports
LORA_POWER (bidir), RFM_DIO0 (bidir), RFM_DIO1 (bidir), RFM_DIO2 (bidir), RFM_MISO (bidir), RFM_MOSI (bidir), RFM_NSS (bidir), RFM_RST (bidir), RFM_SCK (bidir)

### Nets
GND: C52.1 C53.1 U9.2(GND) U10.1(GND) U10.2(GND) U10.3(GND) U10.4(GND) U10.5(GND) U10.10(GND) U10.11(GND) U10.20(GND) U10.22(GND)
UI_3V_MCU: M51.1
LORA_POWER: U9.4(EN) ; port LORA_POWER
RFM_DIO0: M51e.2 ; port RFM_DIO0
RFM_DIO1: M51c.2 ; port RFM_DIO1
RFM_DIO2: M51d.2 ; port RFM_DIO2
RFM_MISO: U10.16(MISO) ; port RFM_MISO
RFM_MOSI: U10.17(MOSI) ; port RFM_MOSI
RFM_NSS: U10.19(NSS) ; port RFM_NSS
RFM_RST: U10.12(RESET) ; port RFM_RST
RFM_SCK: U10.18(SCK) ; port RFM_SCK
NetC52_2: C52.2 M51.2 U9.5(IN)
NetC53_2: C53.2 U9.1(OUT) U10.9(VCC)
NetLORA_ANT_1: LORA_ANT.1 U10.21(ANT)
NetM51a_2: M51a.2 U10.6(RXEN)
NetM51b_2: M51b.2 U10.7(TXEN)
NetM51c_1: M51c.1 U10.13(DIO1)
NetM51d_1: M51d.1 U10.8(DIO2)
NetM51e_1: M51e.1 U10.15(NRST)
NetM51f_1: M51f.1 U10.14(BUSY)

Not connected (* = marked no-connect by the designer): M51a 1*; M51b 1*; M51f 2*; U9 3(FLG)*

### Layout directives
rule Width Constraint [Pref Width = 12mil    Min Width = 12mil    Max Width = 12mil]: NetC52_2, NetC53_2

### Notes on the sheet
- Current control bypass
- (near U9) AP22811A - active high                                 AP22811B - active low                             For switches routed to CPU GPIO pins, just allow change of type via calibration parameter, if HW signal, allow for extra MOSFET on PCB
- 12
- LORA Baseband
- Date:
- File:
- Revision:
- Sheet
- of
- License:

### Library data of the parts
C52 = CAP SMD 0603  X5R 1礔 25V 10%: as C27 on sheet ui_ext_conn; Manufacturer: *; Manufacturer P/N: *; Order code Farnell: 1288202RL; Value: 1礔; Power: *; Technology: X5R; Temperature  Factor: *; Temperature Max: +125癈; Temperature Min: -55癈; STS Code: *
C53 = CAP: as CC5 on sheet ui_codec; Price: 0.068
LORA_ANT = TP: Test point
M51 M51a M51b M51c M51d M51e M51f = Link: Value: 1K; Published: 8-Jun-2000; Revision: July-2002: Re-released for DXP Platform.; Publisher: Altium Limited
U9 = AP22811: High-side switch; Order: FN 274-8550
U10 = PE22(900M22S): Lora Module

## Sheet ui_audio.SchDoc: mcHF Pro Transceiver UI board
size A3; Author: Krassi Atanassov; CompanyName: MØNKA; Engineer: For radio amateurs experimentation, non-commercial use only. Thank you!; Revision: 0.8.5; SheetTotal: 13
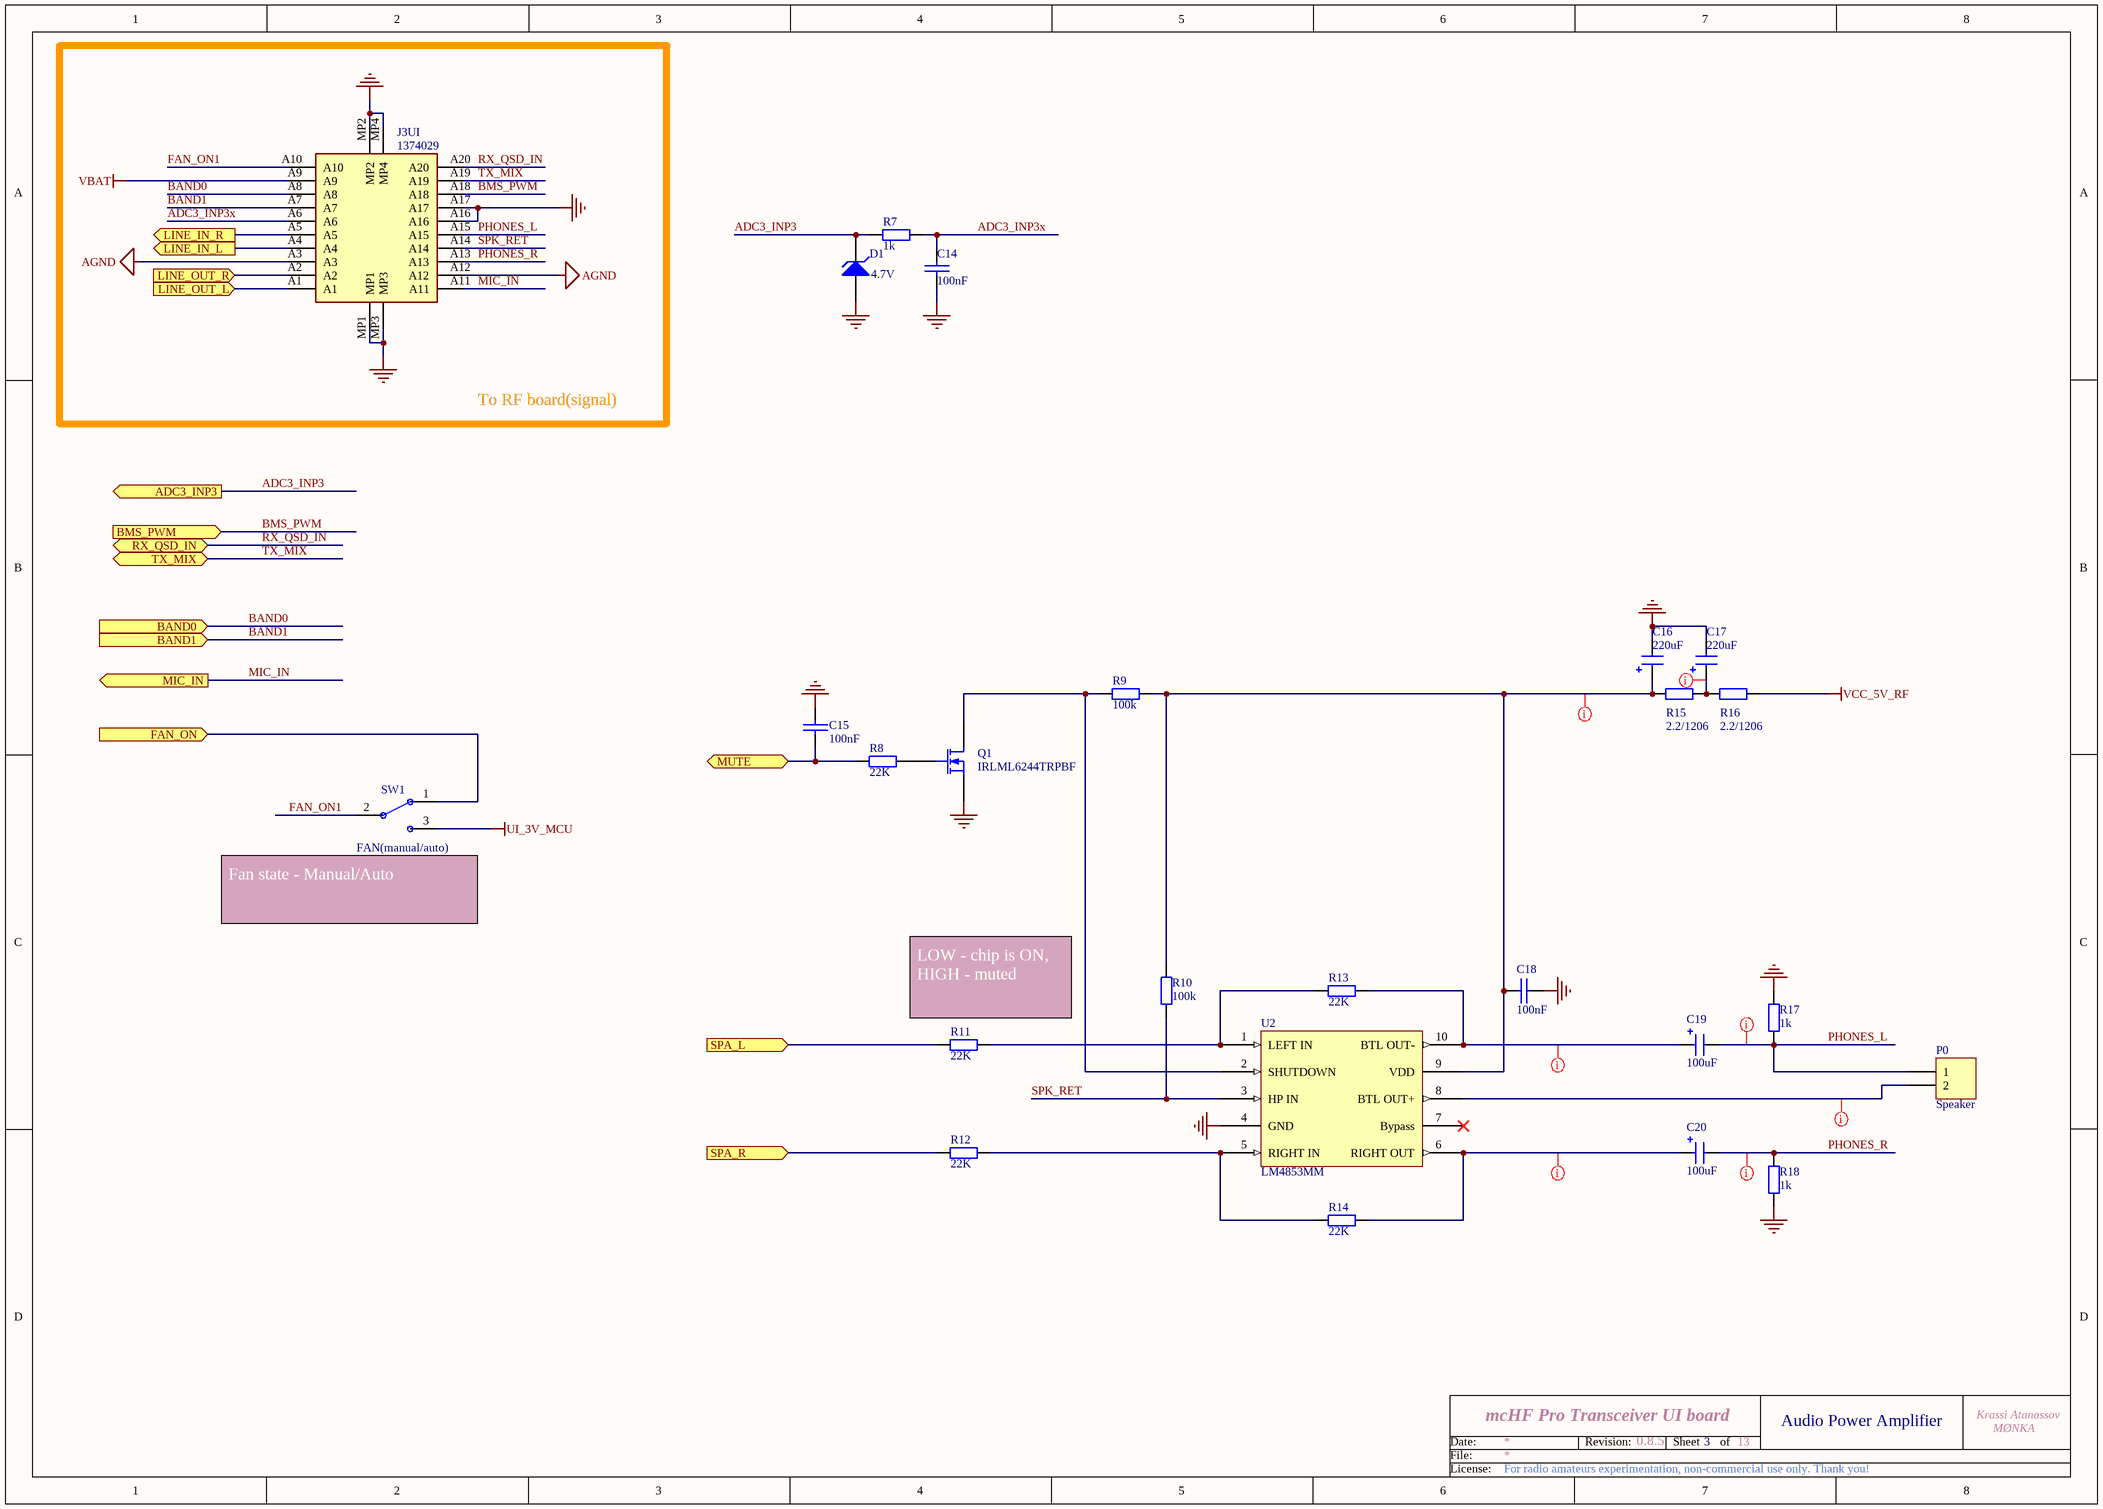
[diagram p11: ui_audio.SchDoc]

### Parts
C14  100nF  [0805]
C15  100nF  [0805]
C16  220uF  [CAP_ALUM_Pro]
C17  220uF  [CAP_ALUM_Pro]
C18  100nF  [0805]
C19  100uF  [CAP_ALUM_Pro]
C20  100uF  [CAP_ALUM_Pro]
D1  4.7V  [0805P]
J3UI  1374029  [1373866]
P0  Speaker  [MHDR1X2_m]
Q1  IRLML6244TRPBF  [SOT-23]
R7  1k  [0805]
R8  22K  [0805]
R9  100k  [0805]
R10  100k  [0805]
R11  22K  [0805]
R12  22K  [0805]
R13  22K  [0805]
R14  22K  [0805]
R15  2.2/1206  [1206]
R16  2.2/1206  [1206]
R17  1k  [0805]
R18  1k  [0805]
SW1  FAN(manual/auto)  [SW3]
U2  LM4853MM  [SLAB-MSOP-10_N]

### Blocks framed on the sheet
To RF board(signal): J3UI

### Ports
ADC3_INP3 (out), BAND0 (in), BAND1 (in), BMS_PWM (in), FAN_ON (in), LINE_IN_L (out), LINE_IN_R (out), LINE_OUT_L (in), LINE_OUT_R (in), MIC_IN (out), MUTE (bidir), RX_QSD_IN (bidir), SPA_L (in), SPA_R (in), TX_MIX (bidir)

### Nets
AGND: J3UI.A3 J3UI.A12
GND: C14.1 C15.1 C16.2 C17.2 C18.1 D1.1(A) J3UI.A16 J3UI.A17 J3UI.MP1 J3UI.MP2 J3UI.MP3 J3UI.MP4 Q1.2(S) R17.2 R18.1 U2.4(GND)
UI_3V_MCU: SW1.3
VBAT: J3UI.A9
VCC_5V_RF: R16.1
ADC3_INP3: D1.2(K) R7.2 ; port ADC3_INP3
ADC3_INP3x: C14.2 J3UI.A6 R7.1
BAND0: J3UI.A8 ; port BAND0
BAND1: J3UI.A7 ; port BAND1
BMS_PWM: J3UI.A18 ; port BMS_PWM
FAN_ON: SW1.1 ; port FAN_ON
FAN_ON1: J3UI.A10 SW1.2
LINE_IN_L: J3UI.A4 ; port LINE_IN_L
LINE_IN_R: J3UI.A5 ; port LINE_IN_R
LINE_OUT_L: J3UI.A1 ; port LINE_OUT_L
LINE_OUT_R: J3UI.A2 ; port LINE_OUT_R
MIC_IN: J3UI.A11 ; port MIC_IN
MUTE: C15.2 R8.2 ; port MUTE
PHONES_L: C19.2 J3UI.A15 P0.1 R17.1
PHONES_R: C20.2 J3UI.A13 R18.2
RX_QSD_IN: J3UI.A20 ; port RX_QSD_IN
SPA_L: R11.2 ; port SPA_L
SPA_R: R12.2 ; port SPA_R
SPK_RET: J3UI.A14 R10.2 U2.3(HP_IN)
TX_MIX: J3UI.A19 ; port TX_MIX
NetC16_1: C16.1 C18.2 R9.1 R10.1 R15.2 U2.9(VDD)
NetC17_1: C17.1 R15.1 R16.2
NetC19_1: C19.1 R13.1 U2.10(BTL_OUT-)
NetC20_1: C20.1 R14.1 U2.6(RIGHT_OUT)
NetP0_2: P0.2 U2.8(BTL_OUT+)
NetQ1_1: Q1.1(G) R8.1
NetQ1_3: Q1.3(D) R9.2 U2.2(SHUTDOWN)
NetR11_1: R11.1 R13.2 U2.1(LEFT_IN)
NetR12_1: R12.1 R14.2 U2.5(RIGHT_IN)

Not connected (* = marked no-connect by the designer): U2 7(Bypass)*

### Layout directives
rule Width Constraint [Pref Width = 12mil    Min Width = 12mil    Max Width = 12mil]: NetC16_1, NetC17_1, NetC19_1, NetC20_1, NetP0_2
rule Width Constraint [Pref Width = 10mil    Min Width = 10mil    Max Width = 10mil]: PHONES_L, PHONES_R

### Notes on the sheet
- (near SW1) Fan state - Manual/Auto
- (near R11) LOW - chip is ON, HIGH - muted
- 3
- Audio Power Amplifier
- Date:
- File:
- Revision:
- Sheet
- of
- License:

### Library data of the parts
C14 C15 C18 = CAP: as CC5 on sheet ui_codec; Price: 0.068
C16 = CAP-POL: Electrolitic capacitor; Notes: Aluminium capacitor; Price: 0.34
C17 C20 = CAP-POL: Electrolitic capacitor; Order: FN 225-4321; QT Order: QCC-00320; Price: 0.34
C19 = CAP-POL: Electrolitic capacitor; Order: FN 225-4321; QT Order: QCC-00320; Notes: Aluminium capacitor; Price: 0.34
D1 = D Zener: Zener Diode; Published: 8-Jun-2000; LatestRevisionDate: 17-Jul-2002; LatestRevisionNote: Re-released for DXP Platform.; PackageReference: DIODE-0.7; Publisher: Altium Limited; PackageDescription: Diode, Thru-Hole; 2 Leads; 0.7 in Pin Spacing
J3UI = 1373866: SMD male connector, nominal current: 2.2 A, Test voltage: 840 VAC, number of positions: 20, pitch: 1.27 mm, color: black, contact surface: Gold, type of contact: Male connector, mounting: SMD soldering; Manufacturer_Name: Phoenix Contact; Geometry.Height: 6.75mm; Mouser Part Number: 651-1373866; Mouser Price/Stock: https://www.mouser.co.uk/ProductDetail/Phoenix-Contact/1373866?qs=2SLPxufLcgAs0enIXKjUUw%3D%3D; Manufacturer_Part_Number: 1373866; Datasheet Link: http://www.phoenixcontact.com/gb/produkte/1373866
P0 = MHDR1X2: Header, 2-Pin; LatestRevisionDate: 17-Jul-2002; LatestRevisionNote: Re-released for DXP Platform.; Publisher: Altium Limited
Q1 = MOSFET-N: N-Channel MOSFET; QT Order: QCT-00022; QT Price: 0.28; Order: FN 186-4517; Price: 0.231
R7 = RES: Resistor; Order: FN 146-9899; QT Order: QCR-00309; Price: 0.023
R8 R11-R14 = RES: Resistor; Order: FN 188-7289; QT Order: QCR-00333; Price: 0.046
R9 R10 = RES: Resistor; Order: FN 157-6459; QT Order: QCR-00579; Price: 0.061
R15 R16 = RES: Resistor; Order: FN 207-8984; QT Order: QCR-00412; Price: 0.02
R17 R18 = RES: as R1 on sheet ui_codec; Price: 0.013
SW1 = SW3: Three pole switch; Order: FN 118-1070; Price: 2.19
U2 = LM4853: Mono 1.5 W / Stereo 300mW Power Amplifier; Notes: 300mW 1ch Mono, 2ch Stereo Audio Amp

## Sheet ui_bt_audio.SchDoc: mcHF Pro Transceiver UI board
size A3; Author: Krassi Atanassov; CompanyName: MØNKA; Engineer: For radio amateurs experimentation, non-commercial use only. Thank you!; Revision: 0.8.5; SheetTotal: 13
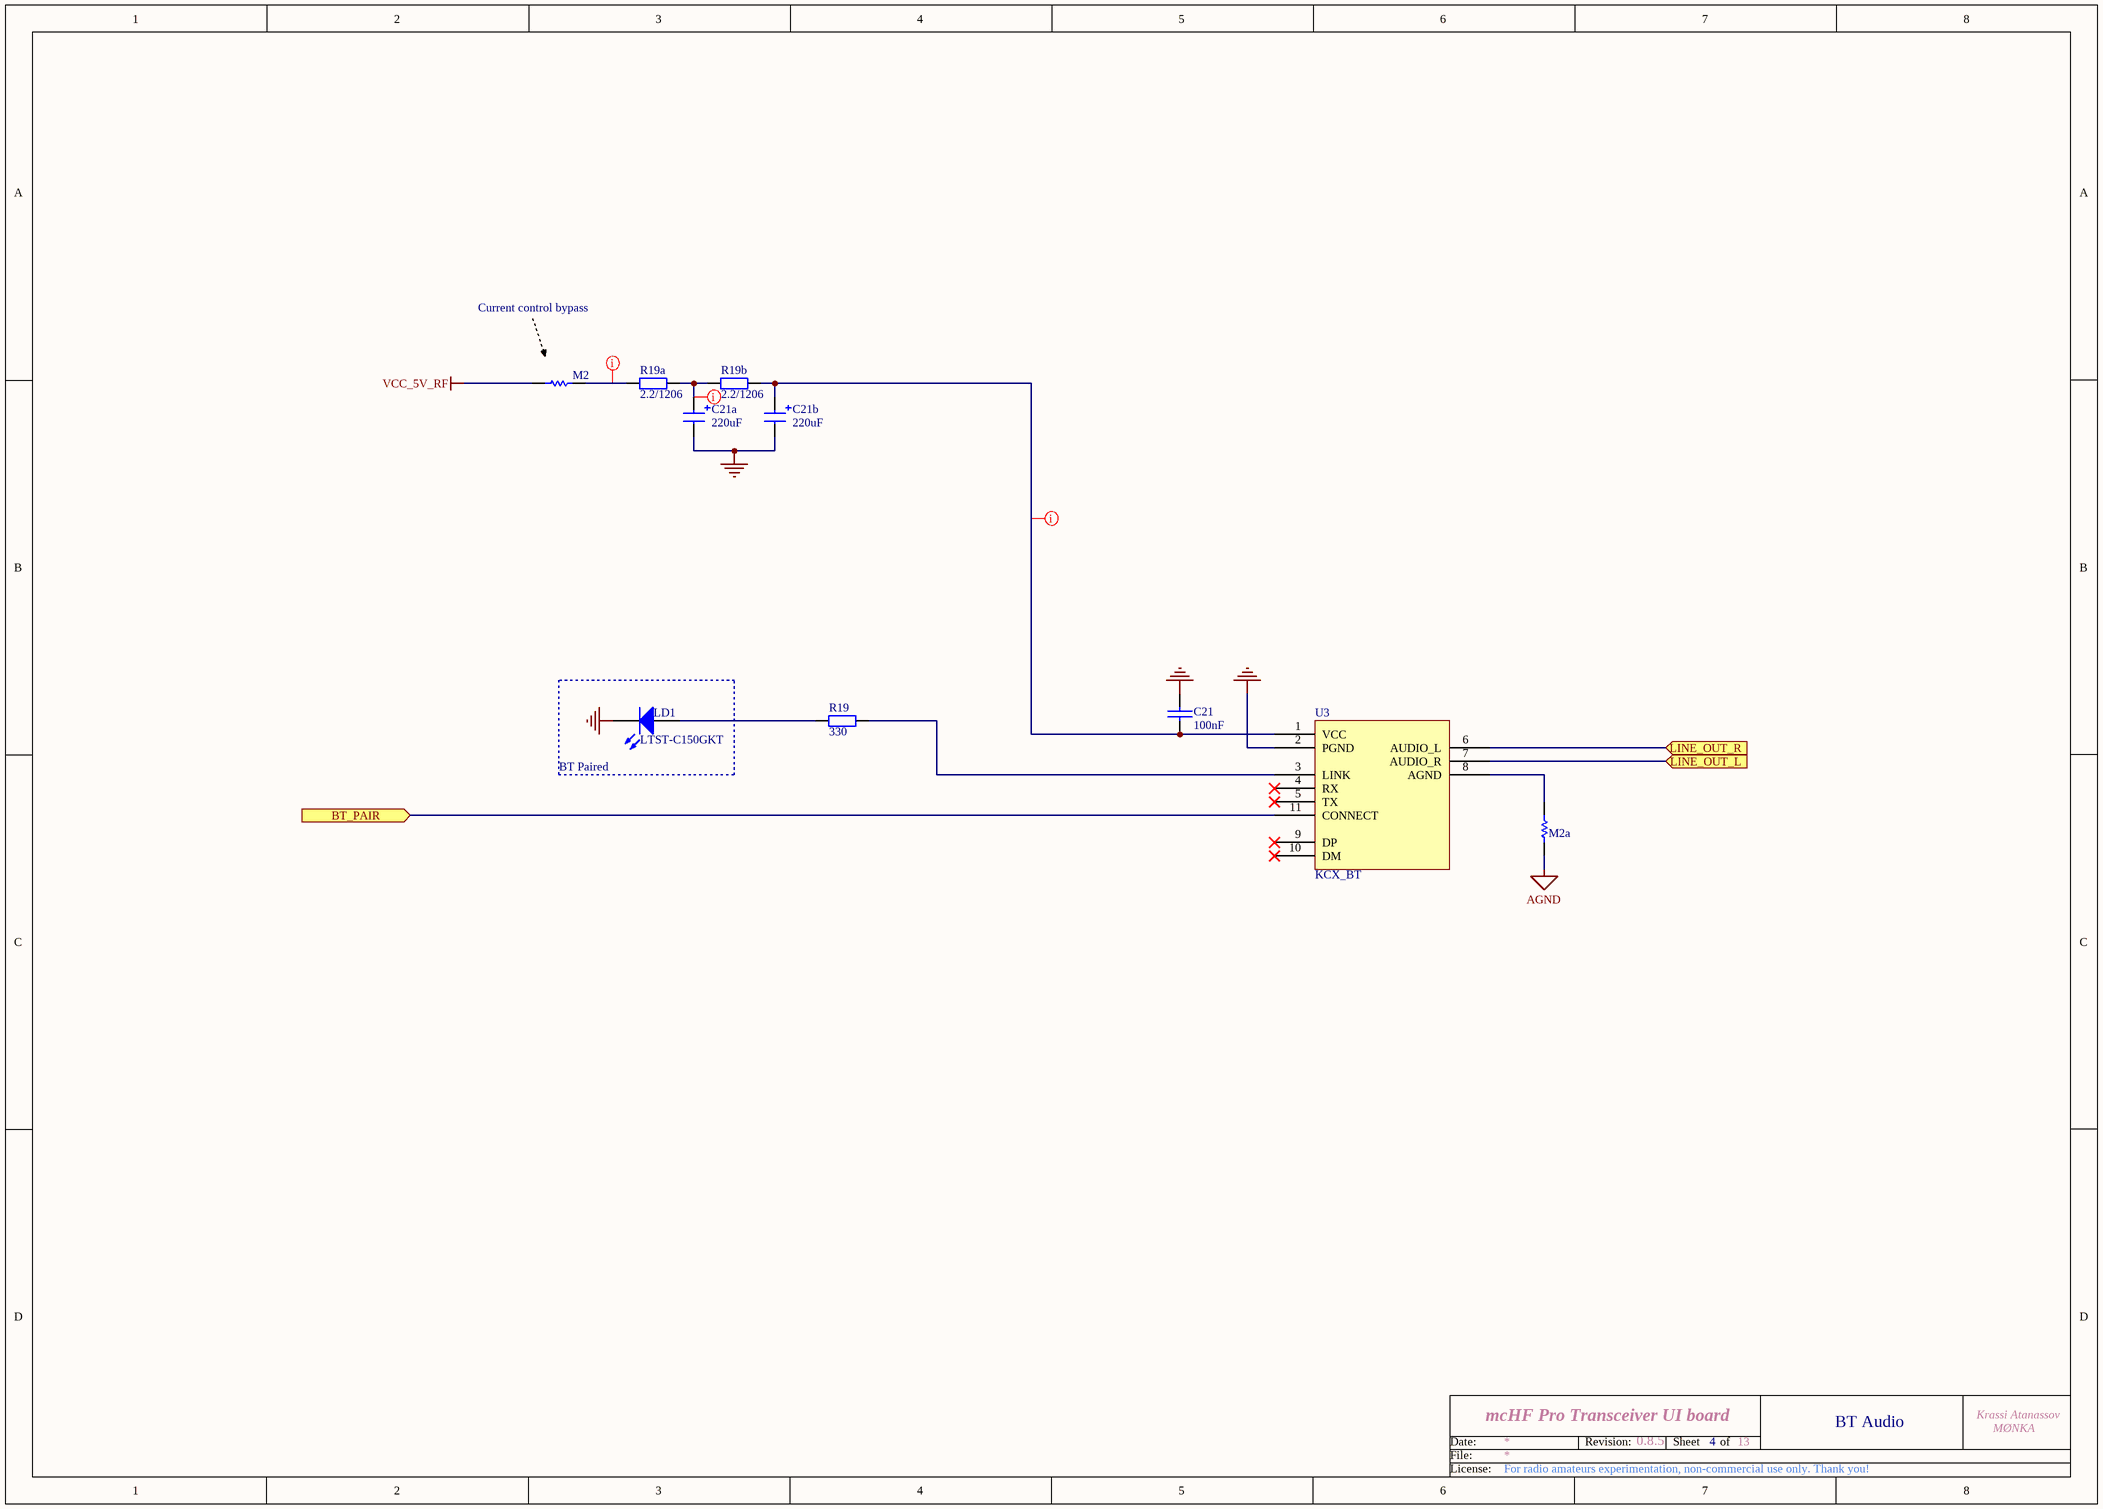
[diagram p12: ui_bt_audio.SchDoc]

### Parts
C21  100nF  [0805]
C21a  220uF  [CAP_ALUM_Pro]
C21b  220uF  [CAP_ALUM_Pro]
LD1  LTST-C150GKT  [1206_Elec_Cap]  (no BOM)
M2  0  [SB_0603]  (value not drawn)  (net tie, no BOM)
M2a  0  [SB_0603]  (value not drawn)  (net tie, no BOM)
R19  330  [0805]
R19a  2.2/1206  [1206]
R19b  2.2/1206  [1206]
U3  KCX_BT  [KCX_BT]

### Blocks framed on the sheet
BT Paired: LD1

### Ports
BT_PAIR (in), LINE_OUT_L (in), LINE_OUT_R (in)

### Nets
AGND: M2a.1
GND: C21.1 C21a.2 C21b.2 LD1.2(K) U3.2(PGND)
VCC_5V_RF: M2.1
BT_PAIR: U3.11(CONNECT) ; port BT_PAIR
LINE_OUT_L: U3.7(AUDIO_R) ; port LINE_OUT_L
LINE_OUT_R: U3.6(AUDIO_L) ; port LINE_OUT_R
NetC21_2: C21.2 C21b.1 R19b.2 U3.1(VCC)
NetC21a_1: C21a.1 R19a.2 R19b.1
NetLD1_1: LD1.1(A) R19.2
NetM2_2: M2.2 R19a.1
NetM2a_2: M2a.2 U3.8(AGND)
NetR19_1: R19.1 U3.3(LINK)

Not connected (* = marked no-connect by the designer): U3 4(RX)* 5(TX)* 9(DP)* 10(DM)*

### Layout directives
rule Width Constraint [Pref Width = 12mil    Min Width = 12mil    Max Width = 12mil]: NetC21_2, NetC21a_1, NetM2_2

### Notes on the sheet
- Current control bypass
- 4
- BT Audio
- Date:
- File:
- Revision:
- Sheet
- of
- License:

### Library data of the parts
C21 = CAP: as CC5 on sheet ui_codec; Price: 0.068
C21a = CAP-POL: as C17 on sheet ui_audio; Price: 0.34
C21b = CAP-POL: as C16 on sheet ui_audio; Price: 0.34
LD1 = LED2: LED 3mm; QT Order: QCD-00052; Revision: July-2002: Re-released for DXP Platform.; Price: 0.116
M2 M2a = Link: Value: 1K; Published: 8-Jun-2000; Revision: July-2002: Re-released for DXP Platform.; Publisher: Altium Limited
R19 = RES: as R7 on sheet ui_audio; Price: 0.023
R19a R19b = RES: as R15 on sheet ui_audio; Price: 0.02
U3 = KCX_BT: KCX_BT_EMITTER V 1.7

## Nets that join several sheets
AGND: ui_lo (J2UI.A11 J2UI.A16), ui_codec (36 pins), ui_audio (J3UI.A3 J3UI.A12), ui_bt_audio (M2a.1)
GND: ui_front (5 pins), ui_conn (15 pins), ui_sdram (24 pins), ui_lcd (21 pins), ui_cpu_power (68 pins), ui_lo (14 pins), ui_ext_conn (23 pins), ui_codec (8 pins), ui_lora (12 pins), ui_audio (16 pins), ui_bt_audio (5 pins)
UI_3V_MCU: ui_conn (D4.2 D5.2 R21a.2 R21b.2), ui_sdram (M50.1), ui_lcd (9 pins), ui_cpu_power (44 pins), ui_lo (M52.1), ui_ext_conn (M4.1 R23a.2), ui_codec (M0.2 R1a.2 R1b.2), ui_lora (M51.1), ui_audio (SW1.3)
VBAT: ui_front (TS1.e), ui_cpu_power (D7.1), ui_audio (J3UI.A9)
VCC_5V_RF: ui_conn (J1UI.A2), ui_lcd (RFC5.1), ui_lo (J2UI.A1 M53.2 M59.2), ui_ext_conn (RFC2.1), ui_audio (R16.1), ui_bt_audio (M2.1)
VCC_20V: ui_conn (J1UI.A1), ui_cpu_power (C34.1 C35.1 R39.2 U6.1)
VREF+: ui_cpu_power (CP43.2 CP43E.1 U5.43), ui_lo (M60.1)
ADC3_INP1: ui_conn (D3.2 R21.2), ui_cpu (U5.41)
ADC3_INP3: ui_cpu (M43.1), ui_audio (D1.2 R7.2)
ADC3_INP6: ui_conn (D2.2 R20.2), ui_cpu (U5.34)
ADC3_INP8: ui_front (R30.1), ui_cpu (U5.30)
ATT_CLK: ui_cpu (U5.65), ui_lo (J2UI.A19)
ATT_DATA: ui_cpu (U5.110), ui_lo (J2UI.A20)
ATT_LE: ui_cpu (U5.87), ui_lo (J2UI.A18)
BAND0: ui_cpu (M34.1), ui_audio (J3UI.A8)
BAND1: ui_cpu (M30.1), ui_audio (J3UI.A7)
BAND2: ui_conn (J1UI.A13), ui_cpu (M7.1)
BAND3: ui_conn (J1UI.A12), ui_cpu (M8.1)
BMS_PRES: ui_conn (J1UI.A14), ui_cpu_power (Q2a.3)
BMS_PWM: ui_cpu (M39.1), ui_audio (J3UI.A18)
BMS_SCL: ui_conn (J1UI.A16 R21b.1), ui_cpu (M45.1)
BMS_SDA: ui_conn (J1UI.A15 R21a.1), ui_cpu (M47.1)
BOOT0: ui_cpu_power (R34.2 U5.194), ui_ext_conn (M3e.1)
BST_EN: ui_conn (J1UI.A7), ui_cpu (M27.1)
BT_PAIR: ui_front (S24.2), ui_bt_audio (U3.11)
CODEC_RESET: ui_cpu (M26.1), ui_codec (U1.6)
CODEC_SCL: ui_cpu (U5.195), ui_codec (R1a.1 U1.2)
CODEC_SDA: ui_cpu (U5.196), ui_codec (R1b.1 U1.1)
DAC1_OUT1: ui_conn (C24.1 J1UI.A10), ui_cpu (U5.57)
DAC1_OUT2: ui_conn (C25.1 J1UI.A9), ui_cpu (U5.58)
DAH_IRQ: ui_conn (D5.3 J1UI.A8 P1.3), ui_cpu (M32.1)
DIAL_DN: ui_front (C31.1 TS1.d), ui_cpu (U5.166)
DIAL_UP: ui_front (C30.1 TS1.b), ui_cpu (U5.46)
DIT_IRQ: ui_conn (D4.3 J1UI.A18 P1.1), ui_cpu (M32a.1)
DSI_CLK_N: ui_cpu (U5.125), ui_lcd (J7.15)
DSI_CLK_P: ui_cpu (U5.124), ui_lcd (J7.14)
DSI_D0_N: ui_cpu (U5.122), ui_lcd (J7.18)
DSI_D0_P: ui_cpu (U5.121), ui_lcd (J7.17)
DSI_D1_N: ui_cpu (U5.128), ui_lcd (J7.12)
DSI_D1_P: ui_cpu (U5.127), ui_lcd (J7.11)
DSI_RESET: ui_cpu (M10.1), ui_lcd (J7.9 J8.7)
DSI_TE: ui_cpu (U5.88), ui_lcd (J7.8)
ENC2_I: ui_conn (J1UI.A4), ui_cpu (U5.190)
ENC2_Q: ui_conn (J1UI.A5), ui_cpu (U5.143)
FAN_ON: ui_cpu (M38.1), ui_audio (SW1.1)
FMC_A0: ui_cpu (U5.22), ui_sdram (U8.25)
FMC_A1: ui_cpu (U5.23), ui_sdram (U8.26)
FMC_A2: ui_cpu (U5.24), ui_sdram (U8.27)
FMC_A3: ui_cpu (U5.25), ui_sdram (U8.60)
FMC_A4: ui_cpu (U5.26), ui_sdram (U8.61)
FMC_A5: ui_cpu (U5.27), ui_sdram (U8.62)
FMC_A6: ui_cpu (U5.68), ui_sdram (U8.63)
FMC_A7: ui_cpu (U5.69), ui_sdram (U8.64)
FMC_A8: ui_cpu (U5.70), ui_sdram (U8.65)
FMC_A9: ui_cpu (U5.71), ui_sdram (U8.66)
FMC_A10: ui_cpu (U5.72), ui_sdram (U8.24)
FMC_A11: ui_cpu (U5.75), ui_sdram (U8.21)
FMC_BA0: ui_cpu (U5.134), ui_sdram (U8.22)
FMC_BA1: ui_cpu (U5.135), ui_sdram (U8.23)
FMC_D0: ui_cpu (U5.115), ui_sdram (U8.2)
FMC_D1: ui_cpu (U5.116), ui_sdram (U8.4)
FMC_D2: ui_cpu (U5.170), ui_sdram (U8.5)
FMC_D3: ui_cpu (U5.171), ui_sdram (U8.7)
FMC_D4: ui_cpu (U5.76), ui_sdram (U8.8)
FMC_D5: ui_cpu (U5.77), ui_sdram (U8.10)
FMC_D6: ui_cpu (U5.78), ui_sdram (U8.11)
FMC_D7: ui_cpu (U5.81), ui_sdram (U8.13)
FMC_D8: ui_cpu (U5.82), ui_sdram (U8.74)
FMC_D9: ui_cpu (U5.83), ui_sdram (U8.76)
FMC_D10: ui_cpu (U5.84), ui_sdram (U8.77)
FMC_D11: ui_cpu (U5.85), ui_sdram (U8.79)
FMC_D12: ui_cpu (U5.86), ui_sdram (U8.80)
FMC_D13: ui_cpu (U5.105), ui_sdram (U8.82)
FMC_D14: ui_cpu (U5.106), ui_sdram (U8.83)
FMC_D15: ui_cpu (U5.107), ui_sdram (U8.85)
FMC_D16: ui_cpu (U5.94), ui_sdram (U8.31)
FMC_D17: ui_cpu (U5.95), ui_sdram (U8.33)
FMC_D18: ui_cpu (U5.96), ui_sdram (U8.34)
FMC_D19: ui_cpu (U5.97), ui_sdram (U8.36)
FMC_D20: ui_cpu (U5.98), ui_sdram (U8.37)
FMC_D21: ui_cpu (U5.156), ui_sdram (U8.39)
FMC_D22: ui_cpu (U5.157), ui_sdram (U8.40)
FMC_D23: ui_cpu (U5.158), ui_sdram (U8.42)
FMC_D24: ui_cpu (U5.159), ui_sdram (U8.45)
FMC_D25: ui_cpu (U5.162), ui_sdram (U8.47)
FMC_D26: ui_cpu (U5.163), ui_sdram (U8.48)
FMC_D27: ui_cpu (U5.164), ui_sdram (U8.50)
FMC_D28: ui_cpu (U5.205), ui_sdram (U8.51)
FMC_D29: ui_cpu (U5.206), ui_sdram (U8.53)
FMC_D30: ui_cpu (U5.13), ui_sdram (U8.54)
FMC_D31: ui_cpu (U5.14), ui_sdram (U8.56)
FMC_NBL0: ui_cpu (U5.197), ui_sdram (U8.16)
FMC_NBL1: ui_cpu (U5.198), ui_sdram (U8.71)
FMC_NBL2: ui_cpu (U5.203), ui_sdram (U8.28)
FMC_NBL3: ui_cpu (U5.204), ui_sdram (U8.59)
FMC_SDCKE0: ui_cpu (U5.48), ui_sdram (U8.67)
FMC_SDCLK: ui_cpu (U5.138), ui_sdram (U8.68)
FMC_SDNCAS: ui_cpu (U5.188), ui_sdram (U8.18)
FMC_SDNE0: ui_cpu (U5.51), ui_sdram (U8.20)
FMC_SDNRAS: ui_cpu (U5.67), ui_sdram (U8.19)
FMC_SDNWE: ui_cpu (U5.38), ui_sdram (U8.17)
KEYPAD_X1: ui_front (S0.3 S6.3 S12.3 S18.3), ui_cpu (M13.1)
KEYPAD_X2: ui_front (S1.3 S7.3 S13.3 S19.3), ui_cpu (M35.1)
KEYPAD_X3: ui_front (S2.3 S8.3 S14.3 S20.3), ui_cpu (M28.1)
KEYPAD_X4: ui_front (S3.3 S9.3 S15.3 S21.3), ui_cpu (M29.1)
KEYPAD_X5: ui_front (S4.3 S10.3 S16.3 S22.1), ui_cpu (M14.1)
KEYPAD_X6: ui_front (S5.3 S11.3 S17.3 S23.3), ui_cpu (M5.1)
KEYPAD_Y1: ui_front (S5.4), ui_cpu (M12.1)
KEYPAD_Y2: ui_front (S11.4), ui_cpu (M33.1)
KEYPAD_Y3: ui_front (S17.4), ui_cpu (M37.1)
KEYPAD_Y4: ui_front (S23.4), ui_cpu (M36.1)
LCD_BL_CTRL: ui_cpu (M44.1), ui_lcd (R42.1)
LINE_IN_L: ui_codec (C10.2), ui_audio (J3UI.A4)
LINE_IN_R: ui_codec (C11.2), ui_audio (J3UI.A5)
LINE_OUT_L: ui_codec (C4.2), ui_audio (J3UI.A1), ui_bt_audio (U3.7)
LINE_OUT_R: ui_codec (C5.2), ui_audio (J3UI.A2), ui_bt_audio (U3.6)
LO_SCL: ui_cpu (U5.52), ui_lo (R51.2)
LO_SDA: ui_cpu (U5.53), ui_lo (R52.2)
LORA_POWER: ui_cpu (M17.1), ui_lora (U9.4)
MIC_IN: ui_codec (C12.2 C13.2 R2.1), ui_audio (J3UI.A11)
MUTE: ui_cpu (R31.2), ui_codec (R1.1), ui_audio (C15.2 R8.2)
NetC6_2: ui_lo (J2UI.A14), ui_codec (C6.2)
NetC7_2: ui_lo (J2UI.A15), ui_codec (C7.2)
NetC8_2: ui_lo (J2UI.A12), ui_codec (C8.2)
NetC9_2: ui_lo (J2UI.A13), ui_codec (C9.2)
NetR59_1: ui_cpu_power (U5.35), ui_lo (R59.1)
NRST: ui_cpu_power (R32.2 U5.37), ui_ext_conn (M3d.2)
OTG_HS_DM: ui_cpu (U5.103), ui_ext_conn (J5.3)
OTG_HS_DP: ui_cpu (U5.104), ui_ext_conn (J5.2)
POWER_BUTTON: ui_front (C29.2 TS1.c), ui_cpu (M15.1), ui_cpu_power (D9.1)
POWER_HOLD: ui_cpu (M6.1), ui_cpu_power (D10.1)
PROG_HOLD: ui_cpu_power (Q2.3 R39.1 U6.5), ui_ext_conn (M3h.1)
PTT: ui_conn (J1UI.A17), ui_cpu (M25.1), ui_lo (J2UI.A2)
RFM_DIO0: ui_cpu (M23.1), ui_lora (M51e.2)
RFM_DIO1: ui_cpu (M22.1), ui_lora (M51c.2)
RFM_DIO2: ui_cpu (M18.1), ui_lora (M51d.2)
RFM_MISO: ui_cpu (M19.1), ui_lora (U10.16)
RFM_MOSI: ui_cpu (M20.1), ui_lora (U10.17)
RFM_NSS: ui_cpu (M21.1), ui_lora (U10.19)
RFM_RST: ui_cpu (M16.1), ui_lora (U10.12)
RFM_SCK: ui_cpu (M24.1), ui_lora (U10.18)
RX_QSD_IN: ui_lo (J2UI.A10), ui_audio (J3UI.A20)
SAI1_FS_A: ui_cpu (U5.3), ui_codec (U1.43)
SAI1_FS_B: ui_cpu (U5.33), ui_codec (U1.39)
SAI1_MCLK_A: ui_cpu (U5.137), ui_codec (U1.44)
SAI1_SCK_A: ui_cpu (U5.4), ui_codec (U1.42)
SAI1_SCK_B: ui_cpu (U5.32), ui_codec (U1.38)
SAI1_SD_A: ui_cpu (U5.5), ui_codec (U1.41)
SAI1_SD_B: ui_cpu (U5.2), ui_codec (U1.37)
SD_DET: ui_cpu (M40.1), ui_ext_conn (J6.10 R27.2)
SD_PWR_CNTR: ui_cpu (M9.1), ui_ext_conn (U4.4)
SDMMC1_CK: ui_cpu (U5.169), ui_ext_conn (J6.5)
SDMMC1_CMD: ui_cpu (U5.172), ui_ext_conn (J6.3 R28.2)
SDMMC1_D0: ui_cpu (U5.144), ui_ext_conn (J6.7 R26.2)
SDMMC1_D1: ui_cpu (U5.145), ui_ext_conn (J6.8 R25.2)
SDMMC1_D2: ui_cpu (U5.167), ui_ext_conn (J6.1 R24.2)
SDMMC1_D3: ui_cpu (U5.168), ui_ext_conn (J6.2 R29.2)
SPA_L: ui_codec (C2.2), ui_audio (R11.2)
SPA_R: ui_codec (C3.2), ui_audio (R12.2)
SWCLK: ui_cpu (U5.165), ui_ext_conn (M3.2)
SWDIO: ui_cpu (U5.151), ui_ext_conn (M3b.2)
TOUCH_INT: ui_cpu (M11.1), ui_lcd (C50.1 J8.6 R49.2)
TOUCH_SCK: ui_cpu (U5.192), ui_lcd (C49.2 J8.4 R47.2)
TOUCH_SDA: ui_cpu (U5.193), ui_lcd (C48.2 J8.5 R48.2)
TX_MIX: ui_lo (J2UI.A9), ui_audio (J3UI.A19)
USART2_TX: ui_cpu (U5.175), ui_ext_conn (M3a.2)
USB_DFU_N: ui_cpu (U5.149), ui_ext_conn (J4.A7 J4.B7)
USB_DFU_P: ui_cpu (U5.150), ui_ext_conn (J4.A6 J4.B6)
VCC_5V_ON: ui_conn (J1UI.A6), ui_cpu (U5.102)